# Altium project dark_knight.PrjPCB (part 1 of 2)
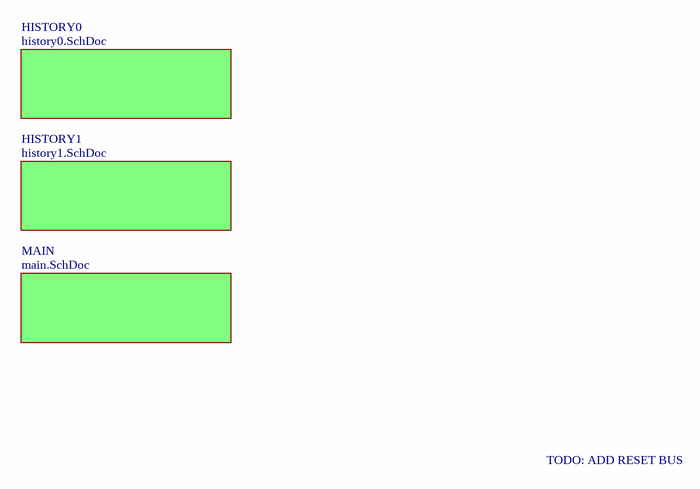
[diagram p0: top.SchDoc]
24 sheets, 105 parts. Net scope: flat (ports and power ports of the same name join across sheets).
Sheets:
  top.SchDoc
    MAIN = main.SchDoc
      ARRAY = array.SchDoc
        FPGA0 = fpga-top.SchDoc
          FPGA6 = fpga-bank6.SchDoc
          FPGA8 = fpga-bank8.SchDoc
          U_fpga-power = fpga-power.SchDoc
          U_fpga-misc = fpga-misc.SchDoc
        CFG = config-top.SchDoc
          CONFIG0 = config-bank0.SchDoc
          CONFIG1 = config-bank1.SchDoc
          CONFIG3 = config-bank3.SchDoc
          CONFIG4 = config-bank4.SchDoc
          CONFIG6 = config-bank6.SchDoc
          CONFIG7 = config-bank7.SchDoc
          CONFIG2 = config-bank2.SchDoc
          CONFIG8 = config-bank8.SchDoc
          CONFIGMISC = config-misc.SchDoc
          CONFIGGND = config-ground.SchDoc
          CONFIGPWR = config-power.SchDoc
          CONFIGSERDES = config-serdes.SchDoc
    HISTORY0 = history0.SchDoc
  power-v2v5.SchDoc
  power-v1v5.SchDoc

## Sheet top.SchDoc
size Letter; CompanyName: Brinton Engineering, LLC; Address1: 3479 Edison Way; Address2: Menlo Park CA 94025; Address3: +1 (877) 778-8435; Address4: brintonengineering.com; Revision: 1; SheetNumber: 1; SheetTotal: 1

### Sub-sheets
HISTORY0 = history0.SchDoc: no entries
HISTORY1 = history1.SchDoc (file not in this document): no entries
MAIN = main.SchDoc: no entries

### Notes on the sheet
- TODO: ADD RESET BUS
- Title
- Engineer
- Revision
- Drawn By
- Checked By
- Date
- Sheet
- of

## Sheet main.SchDoc
size Letter; CompanyName: Brinton Engineering, LLC; Address1: 3479 Edison Way; Address2: Menlo Park CA 94025; Address3: +1 (877) 778-8435; Address4: brintonengineering.com; Revision: 1; SheetNumber: 1; SheetTotal: 1
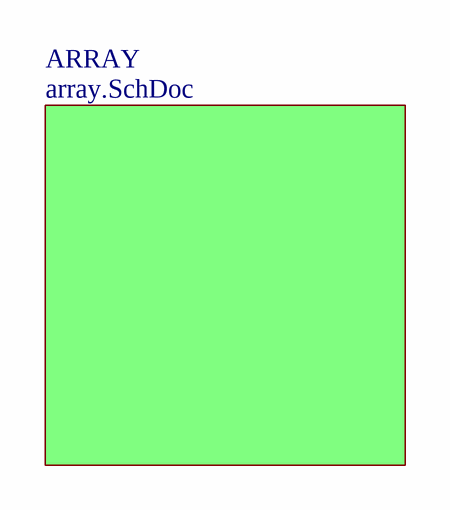
[diagram p1: main.SchDoc]

### Sub-sheets
ARRAY = array.SchDoc: no entries

### Notes on the sheet
- Title
- Engineer
- Revision
- Drawn By
- Checked By
- Date
- Sheet
- of

## Sheet array.SchDoc
size Letter; CompanyName: Brinton Engineering, LLC; Address1: 3479 Edison Way; Address2: Menlo Park CA 94025; Address3: +1 (877) 778-8435; Address4: brintonengineering.com; Revision: 1; SheetNumber: 1; SheetTotal: 1
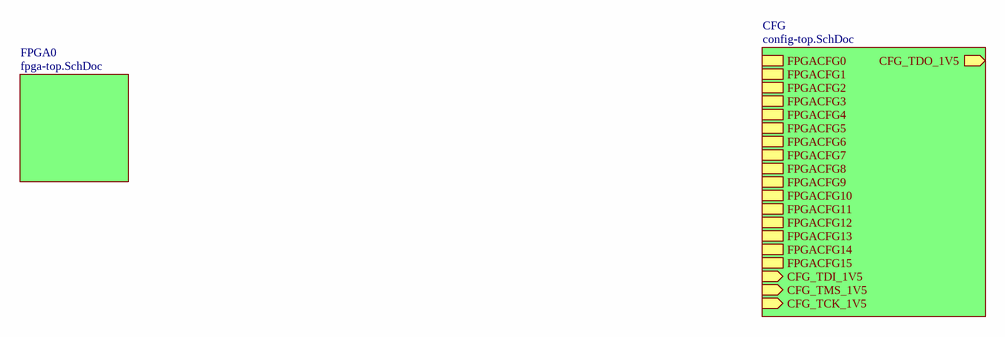
[diagram p2: array.SchDoc]

### Sub-sheets
CFG = config-top.SchDoc: FPGACFG0, FPGACFG1, FPGACFG2, FPGACFG3, FPGACFG4, FPGACFG5, FPGACFG6, FPGACFG7, FPGACFG8, FPGACFG9, FPGACFG10, FPGACFG11, FPGACFG12, FPGACFG13, FPGACFG14, FPGACFG15, CFG_TDI_1V5 (in), CFG_TMS_1V5 (in), CFG_TCK_1V5 (in), CFG_TDO_1V5 (out)
FPGA0 = fpga-top.SchDoc: no entries

### Notes on the sheet
- Title
- Engineer
- Revision
- Drawn By
- Checked By
- Date
- Sheet
- of

## Sheet fpga-top.SchDoc
size Letter; CompanyName: Brinton Engineering, LLC; Address1: 3479 Edison Way; Address2: Menlo Park CA 94025; Address3: +1 (877) 778-8435; Address4: brintonengineering.com; Revision: 1; SheetNumber: 1; SheetTotal: 1
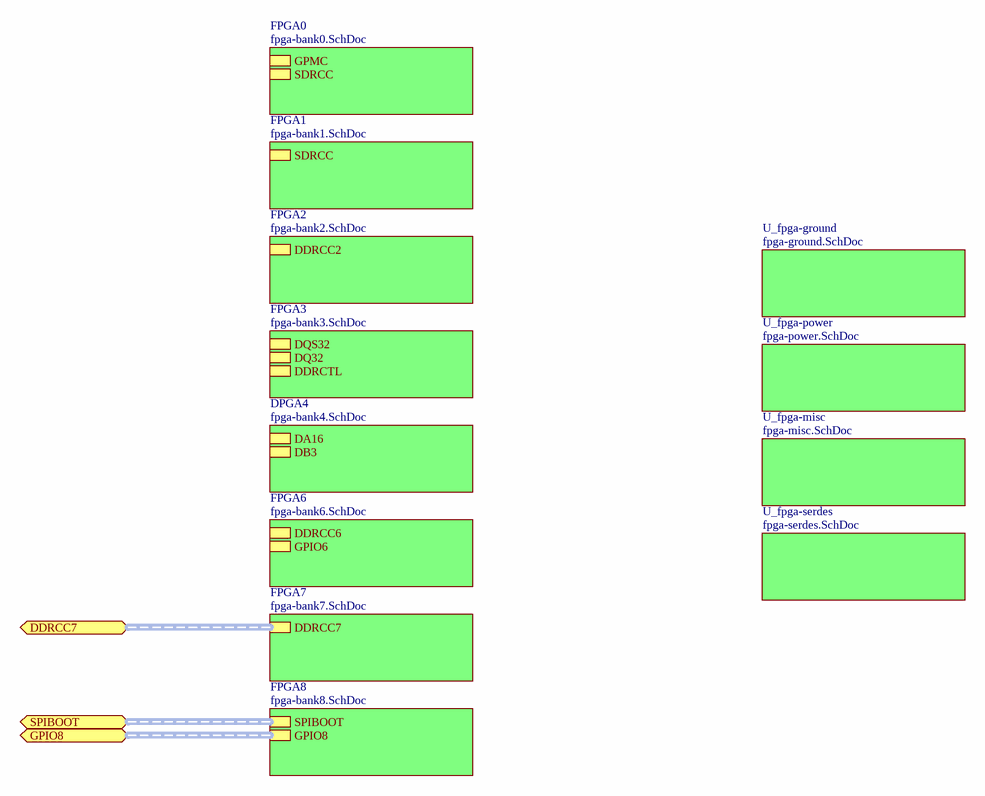
[diagram p3: fpga-top.SchDoc]

### Sub-sheets
DPGA4 = fpga-bank4.SchDoc (file not in this document): DA16 (harness DA16), DB3 (harness DB3)
FPGA0 = fpga-bank0.SchDoc (file not in this document): GPMC (harness GPMC), SDRCC (harness SDRCC)
FPGA1 = fpga-bank1.SchDoc (file not in this document): SDRCC (harness SDRCC)
FPGA2 = fpga-bank2.SchDoc (file not in this document): DDRCC2 (harness DDRCC)
FPGA3 = fpga-bank3.SchDoc (file not in this document): DQS32 (harness DQS32), DQ32 (harness DQ32), DDRCTL (harness DDRCTL)
FPGA6 = fpga-bank6.SchDoc: DDRCC6 (harness DDRCC), GPIO6 (harness GPIO8)
FPGA7 = fpga-bank7.SchDoc (file not in this document): DDRCC7 (harness DDRCC)
FPGA8 = fpga-bank8.SchDoc: SPIBOOT (harness SPIBOOT), GPIO8 (harness GPIO8)
U_fpga-ground = fpga-ground.SchDoc (file not in this document): no entries
U_fpga-misc = fpga-misc.SchDoc: no entries
U_fpga-power = fpga-power.SchDoc: no entries
U_fpga-serdes = fpga-serdes.SchDoc (file not in this document): no entries

### Ports
DDRCC7, GPIO8, SPIBOOT

### Buses and harness runs
harness port DDRCC7 = sheet FPGA7/DDRCC7
harness port GPIO8 = sheet FPGA8/GPIO8
harness port SPIBOOT = sheet FPGA8/SPIBOOT

### Notes on the sheet
- Title
- Engineer
- Revision
- Drawn By
- Checked By
- Date
- Sheet
- of

## Sheet fpga-bank6.SchDoc: FPGA - Bank 6
size Letter; CompanyName: Brinton Engineering, LLC; Address1: 3479 Edison Way; Address2: Menlo Park CA 94025; Address3: +1 (877) 778-8435; Address4: brintonengineering.com; Revision: 1; SheetNumber: 1; SheetTotal: 1
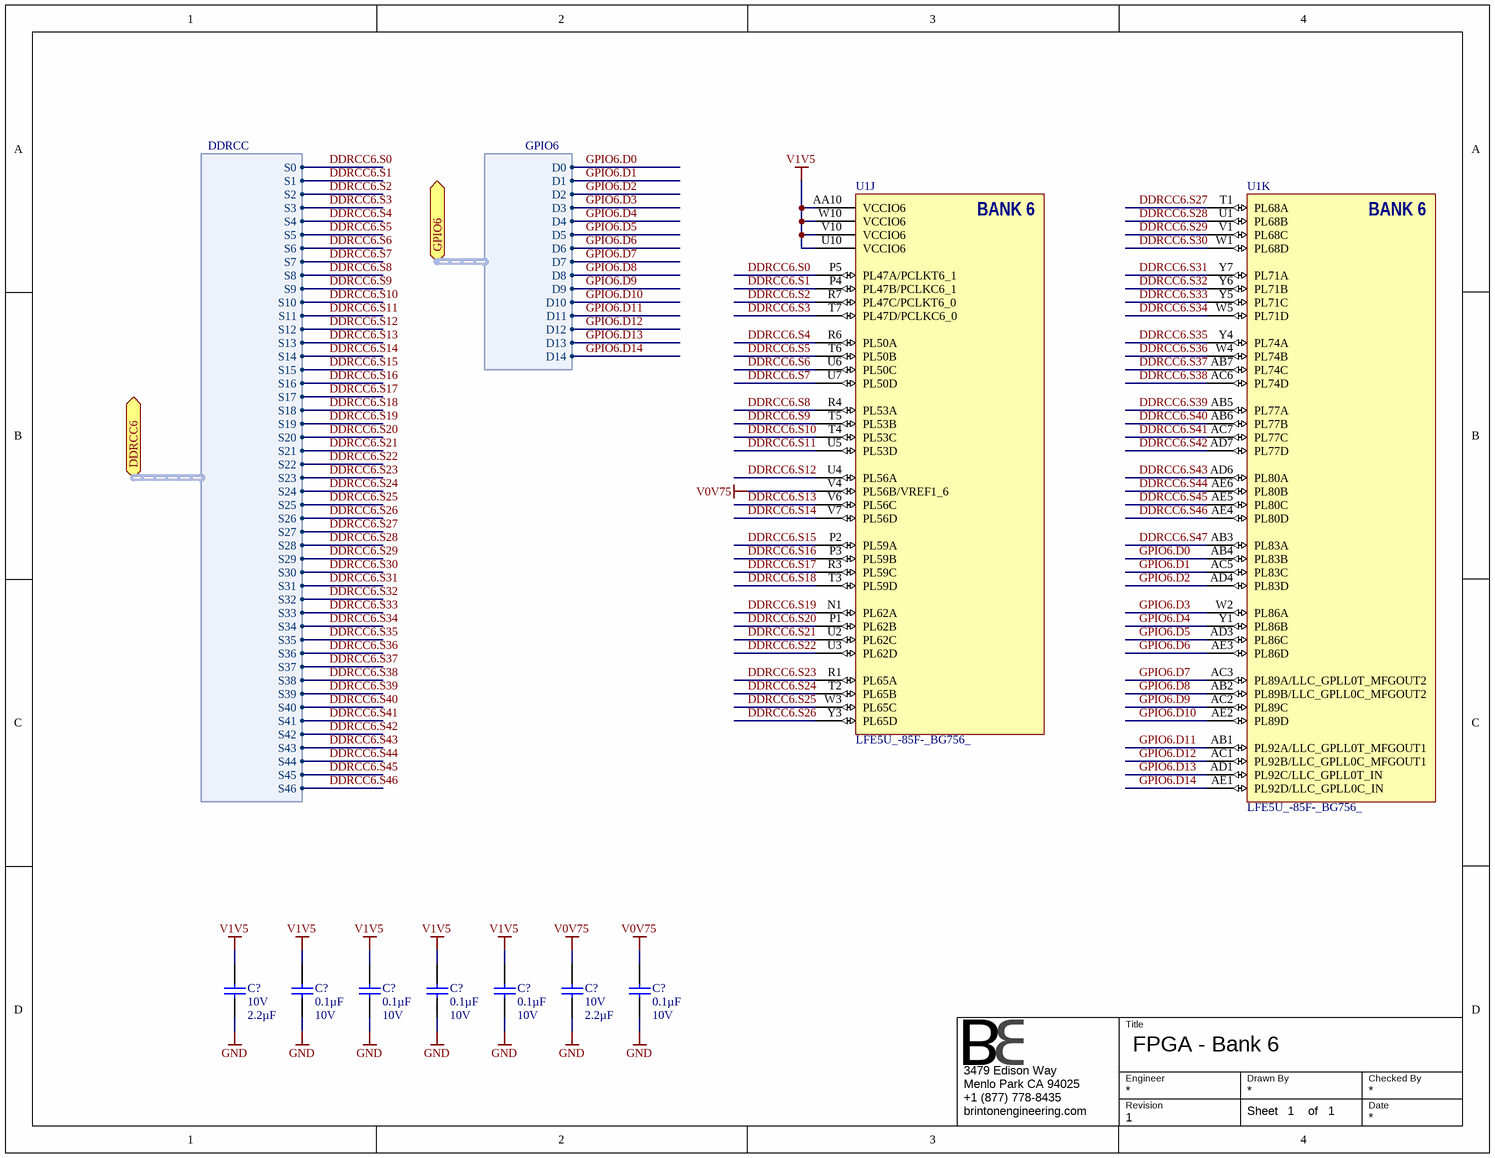
[diagram p4: fpga-bank6.SchDoc]

### Parts
(Parts that share a designator on the sheet are numbered #1, #2 ... from top to bottom, then left to right.)
C?#1  Voltage - Rated: 10V  Capacitance: 2.2µF  [CAPC1608X90N]  (hidden comment: GRM188R71A225KE15D)
C?#2  Capacitance: 0.1µF  Voltage - Rated: 10V  [CAPC1005X56N]  (hidden comment: GRM155R71A104KA01J)
C?#3  Capacitance: 0.1µF  Voltage - Rated: 10V  [CAPC1005X56N]  (hidden comment: GRM155R71A104KA01J)
C?#4  Capacitance: 0.1µF  Voltage - Rated: 10V  [CAPC1005X56N]  (hidden comment: GRM155R71A104KA01J)
C?#5  Capacitance: 0.1µF  Voltage - Rated: 10V  [CAPC1005X56N]  (hidden comment: GRM155R71A104KA01J)
C?#6  Voltage - Rated: 10V  Capacitance: 2.2µF  [CAPC1608X90N]  (hidden comment: GRM188R71A225KE15D)
C?#7  Capacitance: 0.1µF  Voltage - Rated: 10V  [CAPC1005X56N]  (hidden comment: GRM155R71A104KA01J)
U1  LFE5U_-85F-_BG756_  [caBGA756]  (parts J,K of 19)

### Ports
DDRCC6 (harness DDRCC), GPIO6 (harness GPIO6)

### Harnesses
DDRCC: S0, S1, S2, S3, S4, S5, S6, S7, S8, S9, S10, S11, S12, S13, S14, S15, S16, S17, S18, S19, S20, S21, S22, S23, S24, S25, S26, S27, S28, S29, S30, S31, S32, S33, S34, S35, S36, S37, S38, S39, S40, S41, S42, S43, S44, S45, S46
GPIO6: D0, D1, D2, D3, D4, D5, D6, D7, D8, D9, D10, D11, D12, D13, D14

### Nets
GND: C?#1.1 C?#2.1 C?#3.1 C?#4.1 C?#5.1 C?#6.1 C?#7.1
V0V75: C?#6.2 C?#7.2 U1.V4(PL56B/VREF1_6)
V1V5: C?#1.2 C?#2.2 C?#3.2 C?#4.2 C?#5.2 U1.AA10(VCCIO6) U1.U10(VCCIO6) U1.V10(VCCIO6) U1.W10(VCCIO6)
DDRCC6.S0: U1.P5(PL47A/PCLKT6_1) ; port DDRCC6.S0
DDRCC6.S1: U1.P4(PL47B/PCLKC6_1) ; port DDRCC6.S1
DDRCC6.S2: U1.R7(PL47C/PCLKT6_0) ; port DDRCC6.S2
DDRCC6.S3: U1.T7(PL47D/PCLKC6_0) ; port DDRCC6.S3
DDRCC6.S4: U1.R6(PL50A) ; port DDRCC6.S4
DDRCC6.S5: U1.T6(PL50B) ; port DDRCC6.S5
DDRCC6.S6: U1.U6(PL50C) ; port DDRCC6.S6
DDRCC6.S7: U1.U7(PL50D) ; port DDRCC6.S7
DDRCC6.S8: U1.R4(PL53A) ; port DDRCC6.S8
DDRCC6.S9: U1.T5(PL53B) ; port DDRCC6.S9
DDRCC6.S10: U1.T4(PL53C) ; port DDRCC6.S10
DDRCC6.S11: U1.U5(PL53D) ; port DDRCC6.S11
DDRCC6.S12: U1.U4(PL56A) ; port DDRCC6.S12
DDRCC6.S13: U1.V6(PL56C) ; port DDRCC6.S13
DDRCC6.S14: U1.V7(PL56D) ; port DDRCC6.S14
DDRCC6.S15: U1.P2(PL59A) ; port DDRCC6.S15
DDRCC6.S16: U1.P3(PL59B) ; port DDRCC6.S16
DDRCC6.S17: U1.R3(PL59C) ; port DDRCC6.S17
DDRCC6.S18: U1.T3(PL59D) ; port DDRCC6.S18
DDRCC6.S19: U1.N1(PL62A) ; port DDRCC6.S19
DDRCC6.S20: U1.P1(PL62B) ; port DDRCC6.S20
DDRCC6.S21: U1.U2(PL62C) ; port DDRCC6.S21
DDRCC6.S22: U1.U3(PL62D) ; port DDRCC6.S22
DDRCC6.S23: U1.R1(PL65A) ; port DDRCC6.S23
DDRCC6.S24: U1.T2(PL65B) ; port DDRCC6.S24
DDRCC6.S25: U1.W3(PL65C) ; port DDRCC6.S25
DDRCC6.S26: U1.Y3(PL65D) ; port DDRCC6.S26
DDRCC6.S27: U1.T1(PL68A) ; port DDRCC6.S27
DDRCC6.S28: U1.U1(PL68B) ; port DDRCC6.S28
DDRCC6.S29: U1.V1(PL68C) ; port DDRCC6.S29
DDRCC6.S30: U1.W1(PL68D) ; port DDRCC6.S30
DDRCC6.S31: U1.Y7(PL71A) ; port DDRCC6.S31
DDRCC6.S32: U1.Y6(PL71B) ; port DDRCC6.S32
DDRCC6.S33: U1.Y5(PL71C) ; port DDRCC6.S33
DDRCC6.S34: U1.W5(PL71D) ; port DDRCC6.S34
DDRCC6.S35: U1.Y4(PL74A) ; port DDRCC6.S35
DDRCC6.S36: U1.W4(PL74B) ; port DDRCC6.S36
DDRCC6.S37: U1.AB7(PL74C) ; port DDRCC6.S37
DDRCC6.S38: U1.AC6(PL74D) ; port DDRCC6.S38
DDRCC6.S39: U1.AB5(PL77A) ; port DDRCC6.S39
DDRCC6.S40: U1.AB6(PL77B) ; port DDRCC6.S40
DDRCC6.S41: U1.AC7(PL77C) ; port DDRCC6.S41
DDRCC6.S42: U1.AD7(PL77D) ; port DDRCC6.S42
DDRCC6.S43: U1.AD6(PL80A) ; port DDRCC6.S43
DDRCC6.S44: U1.AE6(PL80B) ; port DDRCC6.S44
DDRCC6.S45: U1.AE5(PL80C) ; port DDRCC6.S45
DDRCC6.S46: U1.AE4(PL80D) ; port DDRCC6.S46
DDRCC6.S47: U1.AB3(PL83A)
GPIO6.D0: U1.AB4(PL83B) ; port GPIO6.D0
GPIO6.D1: U1.AC5(PL83C) ; port GPIO6.D1
GPIO6.D2: U1.AD4(PL83D) ; port GPIO6.D2
GPIO6.D3: U1.W2(PL86A) ; port GPIO6.D3
GPIO6.D4: U1.Y1(PL86B) ; port GPIO6.D4
GPIO6.D5: U1.AD3(PL86C) ; port GPIO6.D5
GPIO6.D6: U1.AE3(PL86D) ; port GPIO6.D6
GPIO6.D7: U1.AC3(PL89A/LLC_GPLL0T_MFGOUT2) ; port GPIO6.D7
GPIO6.D8: U1.AB2(PL89B/LLC_GPLL0C_MFGOUT2) ; port GPIO6.D8
GPIO6.D9: U1.AC2(PL89C) ; port GPIO6.D9
GPIO6.D10: U1.AE2(PL89D) ; port GPIO6.D10
GPIO6.D11: U1.AB1(PL92A/LLC_GPLL0T_MFGOUT1) ; port GPIO6.D11
GPIO6.D12: U1.AC1(PL92B/LLC_GPLL0C_MFGOUT1) ; port GPIO6.D12
GPIO6.D13: U1.AD1(PL92C/LLC_GPLL0T_IN) ; port GPIO6.D13
GPIO6.D14: U1.AE1(PL92D/LLC_GPLL0C_IN) ; port GPIO6.D14

### Notes on the sheet
- Title
- Engineer
- Revision
- Drawn By
- Checked By
- Date
- Sheet
- of

### Library data of the parts
C?#1 C?#6 = GRM188R71A225KE15D: CAP CER 2.2UF 10V 10% X7R 0603; Manufacturer: Murata Electronics North America; Manufacturer P/N: GRM188R71A225KE15D; Operating Temperature: -55°C ~ 125°C; Thickness (Max): 0.035" (0.90mm); Tolerance: ±10%; Package / Case: 0603 (1608 Metric); Temperature Coefficient: X7R; Supplier 1: Newark; Supplier 2: Digi-Key; RoHS: RoHS Compliant; Size / Dimension: 0.063" L x 0.031" W (1.60mm x 0.80mm); Mounting Type: Surface Mount, MLCC; ComponentLink1URL: http://www.murata.com/~/media/webrenewal/support/library/catalog/products/capacitor/mlcc/c02e.ashx; ComponentLink1Description: http://www.murata.com/~/media/webrenewal/support/library/catalog/products/capacitor/mlcc/c02e.ashx; Supplier Part Number 1: 72R4209; Supplier Part Number 2: 490-4520-1-ND
C?#2-C?#5 C?#7 = GRM155R71A104KA01J: CAP CER 0.1UF 10V 10% X7R 0402; Manufacturer: Murata Electronics North America; Manufacturer P/N: GRM155R71A104KA01J; Operating Temperature: -55°C ~ 125°C; Thickness (Max): 0.022" (0.55mm); Size / Dimension: 0.039" L x 0.020" W (1.00mm x 0.50mm); RoHS: RoHS Compliant; Mounting Type: Surface Mount, MLCC; Supplier 1: Digi-Key; ComponentLink1URL: http://www.murata.com/~/media/webrenewal/support/library/catalog/products/capacitor/mlcc/c02e.ashx; ComponentLink1Description: http://www.murata.com/~/media/webrenewal/support/library/catalog/products/capacitor/mlcc/c02e.ashx; Supplier Part Number 1: 490-6322-1-ND; Temperature Coefficient: X7R; Package / Case: 0402 (1005 Metric); Tolerance: ±10%
U1 = LFE5U_-85F-_BG756_: ECP5 FPGA, 85k LUT, 756-caBGA; Manufacturer: Lattice Semiconductor; Manufacturer P/N: LFE5U_-85F-_BG756_

## Sheet fpga-bank8.SchDoc: FPGA - Bank 8
size Letter; CompanyName: Brinton Engineering, LLC; Address1: 3479 Edison Way; Address2: Menlo Park CA 94025; Address3: +1 (877) 778-8435; Address4: brintonengineering.com; Revision: 1; SheetNumber: 1; SheetTotal: 1
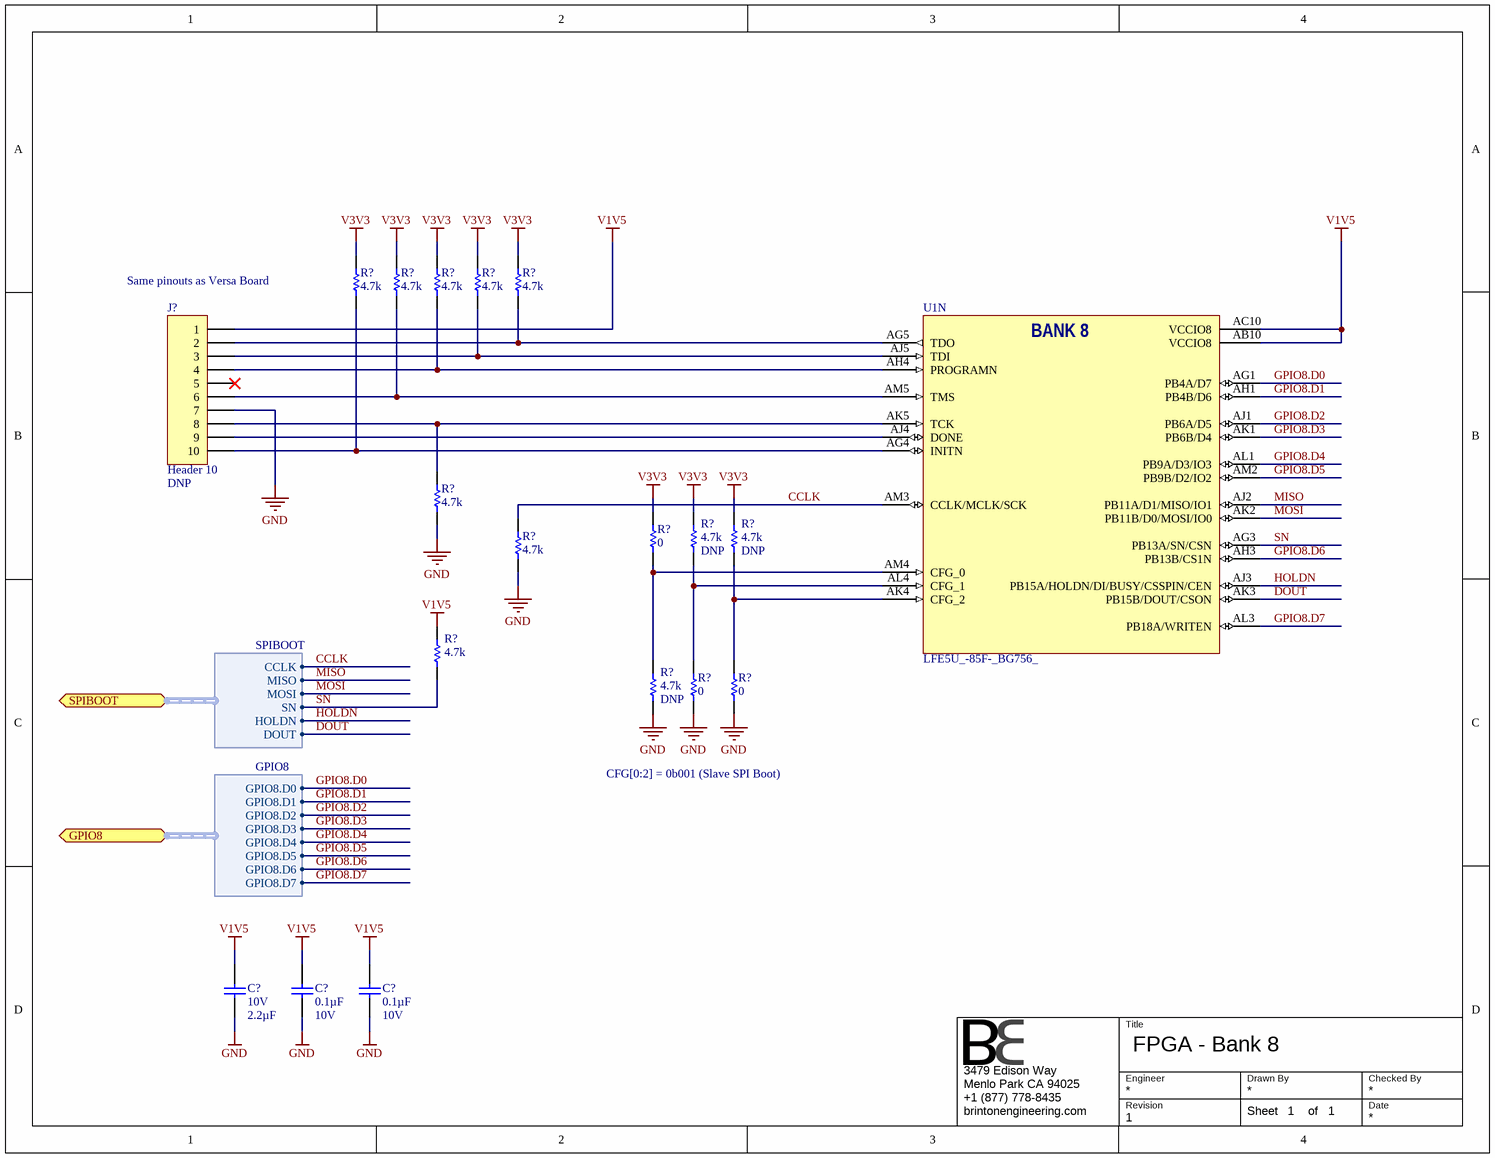
[diagram p5: fpga-bank8.SchDoc]

### Parts
(Parts that share a designator on the sheet are numbered #1, #2 ... from top to bottom, then left to right.)
C?#8  Voltage - Rated: 10V  Capacitance: 2.2µF  [CAPC1608X90N]  (hidden comment: GRM188R71A225KE15D)
C?#9  Capacitance: 0.1µF  Voltage - Rated: 10V  [CAPC1005X56N]  (hidden comment: GRM155R71A104KA01J)
C?#10  Capacitance: 0.1µF  Voltage - Rated: 10V  [CAPC1005X56N]  (hidden comment: GRM155R71A104KA01J)
J?  Header 10  Do Not Place: DNP  [HDR1X10]
R?#1  value 4.7k  [0603]  (hidden comment: RES 0603 4.7k 1%)
R?#2  value 4.7k  [0603]  (hidden comment: RES 0603 4.7k 1%)
R?#3  value 4.7k  [0603]  (hidden comment: RES 0603 4.7k 1%)
R?#4  value 4.7k  [0603]  (hidden comment: RES 0603 4.7k 1%)
R?#5  value 4.7k  [0603]  (hidden comment: RES 0603 4.7k 1%)
R?#6  value 4.7k  [0603]  (hidden comment: RES 0603 4.7k 1%)
R?#7  value 0  [0603]  (hidden comment: RES 0603 0)
R?#8  value 4.7k  Do Not Place: DNP  [0603]  (hidden comment: RES 0603 4.7k 1%)
R?#9  value 4.7k  Do Not Place: DNP  [0603]  (hidden comment: RES 0603 4.7k 1%)
R?#10  value 4.7k  [0603]  (hidden comment: RES 0603 4.7k 1%)
R?#11  value 4.7k  [0603]  (hidden comment: RES 0603 4.7k 1%)
R?#12  value 4.7k  Do Not Place: DNP  [0603]  (hidden comment: RES 0603 4.7k 1%)
R?#13  value 0  [0603]  (hidden comment: RES 0603 0)
R?#14  value 0  [0603]  (hidden comment: RES 0603 0)
U1  LFE5U_-85F-_BG756_  [caBGA756]  (part N of 19)

### Ports
GPIO8 (harness GPIO8), SPIBOOT (harness SPIBOOT)

### Harnesses
SPIBOOT: CCLK, MISO, MOSI, SN, HOLDN, DOUT
GPIO8: GPIO8.D0, GPIO8.D1, GPIO8.D2, GPIO8.D3, GPIO8.D4, GPIO8.D5, GPIO8.D6, GPIO8.D7

### Nets
GND: C?#8.1 C?#9.1 C?#10.1 J?.7 R?#6.1 R?#10.1 R?#12.1 R?#13.1 R?#14.1
V1V5: C?#8.2 C?#9.2 C?#10.2 J?.1 R?#11.2 U1.AB10(VCCIO8) U1.AC10(VCCIO8)
V3V3: R?#1.2 R?#2.2 R?#3.2 R?#4.2 R?#5.2 R?#7.2 R?#8.2 R?#9.2
CCLK: R?#10.2 U1.AM3(CCLK/MCLK/SCK) ; port SPIBOOT.CCLK
DOUT: U1.AK3(PB15B/DOUT/CSON) ; port SPIBOOT.DOUT
GPIO8.D0: U1.AG1(PB4A/D7) ; port GPIO8.GPIO8.D0
GPIO8.D1: U1.AH1(PB4B/D6) ; port GPIO8.GPIO8.D1
GPIO8.D2: U1.AJ1(PB6A/D5) ; port GPIO8.GPIO8.D2
GPIO8.D3: U1.AK1(PB6B/D4) ; port GPIO8.GPIO8.D3
GPIO8.D4: U1.AL1(PB9A/D3/IO3) ; port GPIO8.GPIO8.D4
GPIO8.D5: U1.AM2(PB9B/D2/IO2) ; port GPIO8.GPIO8.D5
GPIO8.D6: U1.AH3(PB13B/CS1N) ; port GPIO8.GPIO8.D6
GPIO8.D7: U1.AL3(PB18A/WRITEN) ; port GPIO8.GPIO8.D7
HOLDN: U1.AJ3(PB15A/HOLDN/DI/BUSY/CSSPIN/CEN) ; port SPIBOOT.HOLDN
MISO: U1.AJ2(PB11A/D1/MISO/IO1) ; port SPIBOOT.MISO
MOSI: U1.AK2(PB11B/D0/MOSI/IO0) ; port SPIBOOT.MOSI
SN: R?#11.1 U1.AG3(PB13A/SN/CSN) ; port SPIBOOT.SN
NetJ?_2: J?.2 R?#5.1 U1.AG5(TDO)
NetJ?_3: J?.3 R?#4.1 U1.AJ5(TDI)
NetJ?_4: J?.4 R?#3.1 U1.AH4(PROGRAMN)
NetJ?_6: J?.6 R?#2.1 U1.AM5(TMS)
NetJ?_8: J?.8 R?#6.2 U1.AK5(TCK)
NetJ?_9: J?.9 U1.AJ4(DONE)
NetJ?_10: J?.10 R?#1.1 U1.AG4(INITN)
NetR?#7_1: R?#7.1 R?#12.2 U1.AM4(CFG_0)
NetR?#8_1: R?#8.1 R?#13.2 U1.AL4(CFG_1)
NetR?#9_1: R?#9.1 R?#14.2 U1.AK4(CFG_2)

Not connected (* = marked no-connect by the designer): J? 5*

### Notes on the sheet
- (near J?) Same pinouts as Versa Board
- CFG[0:2] = 0b001 (Slave SPI Boot)
- Title
- Engineer
- Revision
- Drawn By
- Checked By
- Date
- Sheet
- of
- (in symbol LFE5U_-85F-_BG756_, part N) BANK 8

### Library data of the parts
C?#8 = GRM188R71A225KE15D: as C?#1 on sheet fpga-bank6; Manufacturer P/N: GRM188R71A225KE15D; Operating Temperature: -55°C ~ 125°C; Thickness (Max): 0.035" (0.90mm); Tolerance: ±10%; Package / Case: 0603 (1608 Metric); Temperature Coefficient: X7R; Supplier 1: Newark; Supplier 2: Digi-Key; RoHS: RoHS Compliant; Size / Dimension: 0.063" L x 0.031" W (1.60mm x 0.80mm); Mounting Type: Surface Mount, MLCC; ComponentLink1URL: http://www.murata.com/~/media/webrenewal/support/library/catalog/products/capacitor/mlcc/c02e.ashx; ComponentLink1Description: http://www.murata.com/~/media/webrenewal/support/library/catalog/products/capacitor/mlcc/c02e.ashx; Supplier Part Number 1: 72R4209; Supplier Part Number 2: 490-4520-1-ND
C?#9 C?#10 = GRM155R71A104KA01J: as C?#2 on sheet fpga-bank6; Manufacturer P/N: GRM155R71A104KA01J; Operating Temperature: -55°C ~ 125°C; Thickness (Max): 0.022" (0.55mm); Size / Dimension: 0.039" L x 0.020" W (1.00mm x 0.50mm); RoHS: RoHS Compliant; Mounting Type: Surface Mount, MLCC; Supplier 1: Digi-Key; ComponentLink1URL: http://www.murata.com/~/media/webrenewal/support/library/catalog/products/capacitor/mlcc/c02e.ashx; ComponentLink1Description: http://www.murata.com/~/media/webrenewal/support/library/catalog/products/capacitor/mlcc/c02e.ashx; Supplier Part Number 1: 490-6322-1-ND; Temperature Coefficient: X7R; Package / Case: 0402 (1005 Metric); Tolerance: ±10%
J? = Header 10: Header, 10-Pin; LatestRevisionDate: 17-Jul-2002; LatestRevisionNote: Re-released for DXP Platform.; Publisher: Altium Limited
R?#1-R?#6 R?#8-R?#12 = RES 0603 10k 1%: Thick Film Resistor 4.7k Ohms +/-1% 0.1W 75V SMD 0603; Manufacturer: Panasonic - ECG; Manufacturer P/N: ERJ3EKF4701V; Tcr: +/-100; Tr: -55:+155; Tolerance: +/-1%; Alternatives: *; Voltage: 75V; Power: 0.1W; P/N: ERJ3EKF4701V
  R?#11: Do Not Place: *
R?#7 R?#13 R?#14 = RES 0603 10k 1%: Thick Film Resistor 0 Ohms SMD 0603; Manufacturer: Panasonic - ECG; Manufacturer P/N: ERJ-3GEY0R00V; Tcr: +/-100; Tolerance: +/-1%; Tr: -55:+155; Voltage: 75V; Power: 0.1W; Alternatives: *; P/N: ERJ-3GEY0R00V
U1 = LFE5U_-85F-_BG756_: as U1 on sheet fpga-bank6; Manufacturer P/N: LFE5U_-85F-_BG756_

## Sheet fpga-power.SchDoc: FPGA - Power
size Letter; CompanyName: Brinton Engineering, LLC; Address1: 3479 Edison Way; Address2: Menlo Park CA 94025; Address3: +1 (877) 778-8435; Address4: brintonengineering.com; Revision: 1; SheetNumber: 1; SheetTotal: 1
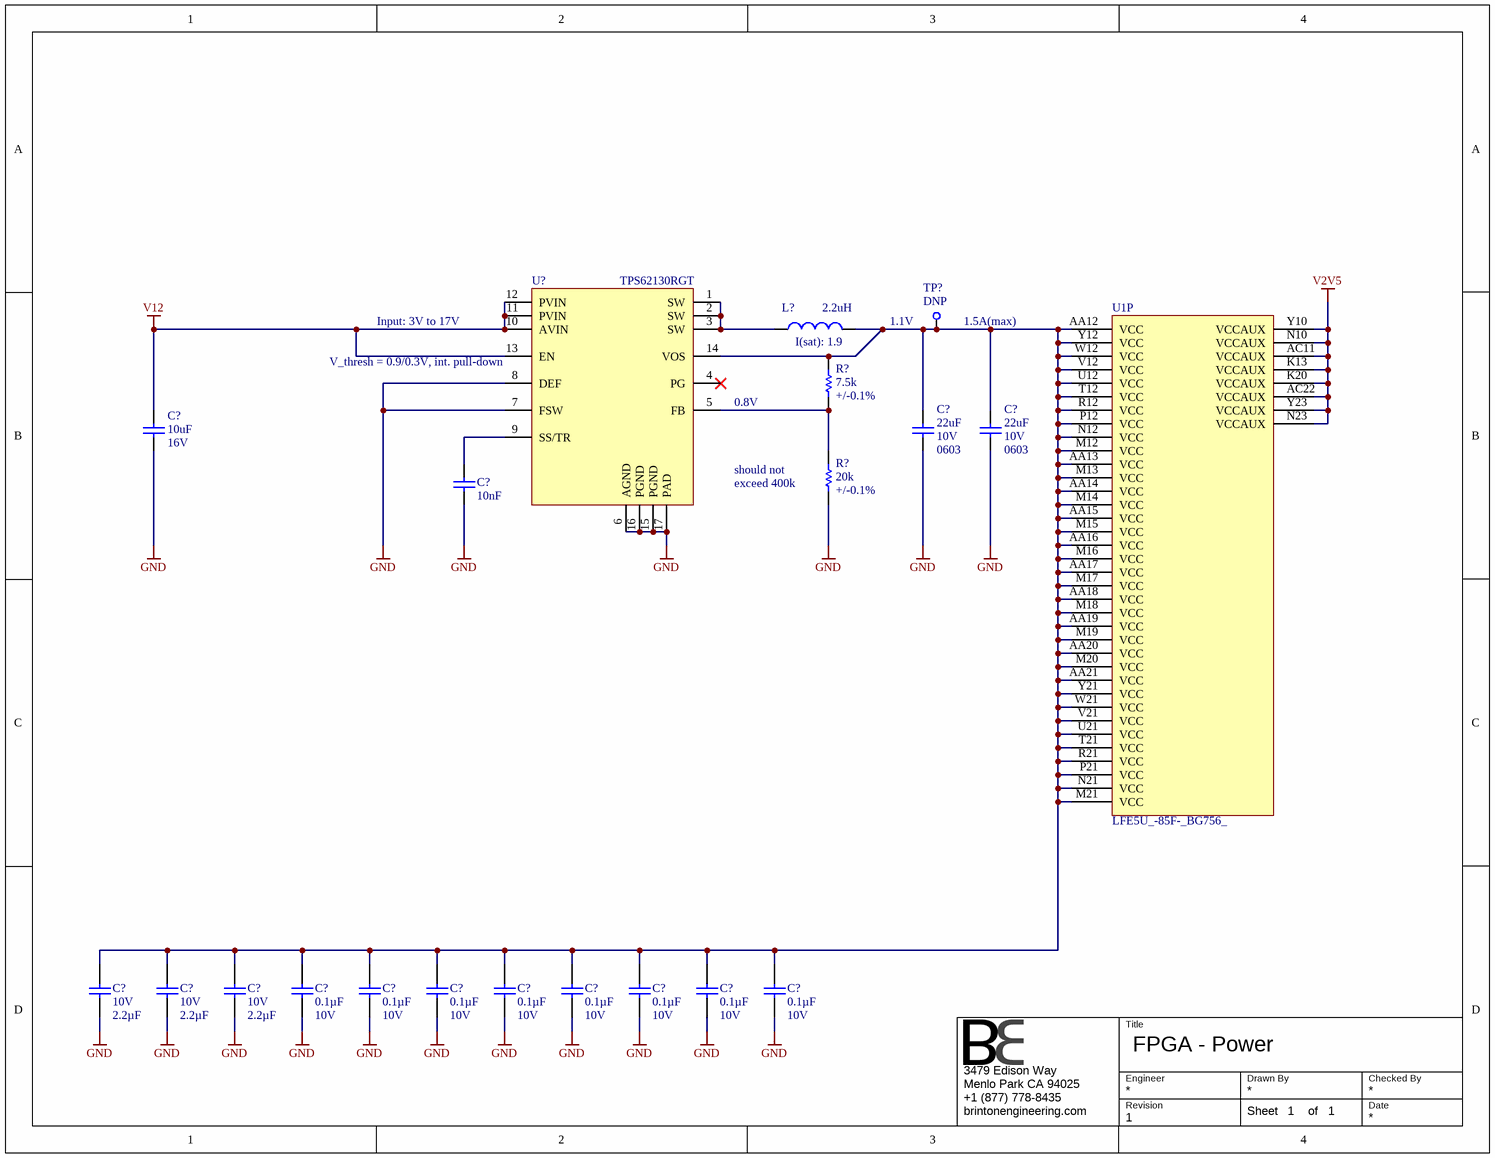
[diagram p6: fpga-power.SchDoc]

### Parts
(Parts that share a designator on the sheet are numbered #1, #2 ... from top to bottom, then left to right.)
C?#11  value 22uF  Voltage: 10V  [0603]  (hidden comment: C1608X5R1A226M080AC)
C?#12  value 22uF  Voltage: 10V  [0603]  (hidden comment: C1608X5R1A226M080AC)
C?#13  value 10uF  Voltage: 16V  [0603]  (hidden comment: CAP 10UF 0603)
C?#14  value 10nF  [0201]  (hidden comment: CAP 10NF 0201)
C?#15  Voltage - Rated: 10V  Capacitance: 2.2µF  [CAPC1608X90N]  (hidden comment: GRM188R71A225KE15D)
C?#16  Voltage - Rated: 10V  Capacitance: 2.2µF  [CAPC1608X90N]  (hidden comment: GRM188R71A225KE15D)
C?#17  Voltage - Rated: 10V  Capacitance: 2.2µF  [CAPC1608X90N]  (hidden comment: GRM188R71A225KE15D)
C?#18  Capacitance: 0.1µF  Voltage - Rated: 10V  [CAPC1005X56N]  (hidden comment: GRM155R71A104KA01J)
C?#19  Capacitance: 0.1µF  Voltage - Rated: 10V  [CAPC1005X56N]  (hidden comment: GRM155R71A104KA01J)
C?#20  Capacitance: 0.1µF  Voltage - Rated: 10V  [CAPC1005X56N]  (hidden comment: GRM155R71A104KA01J)
C?#21  Capacitance: 0.1µF  Voltage - Rated: 10V  [CAPC1005X56N]  (hidden comment: GRM155R71A104KA01J)
C?#22  Capacitance: 0.1µF  Voltage - Rated: 10V  [CAPC1005X56N]  (hidden comment: GRM155R71A104KA01J)
C?#23  Capacitance: 0.1µF  Voltage - Rated: 10V  [CAPC1005X56N]  (hidden comment: GRM155R71A104KA01J)
C?#24  Capacitance: 0.1µF  Voltage - Rated: 10V  [CAPC1005X56N]  (hidden comment: GRM155R71A104KA01J)
C?#25  Capacitance: 0.1µF  Voltage - Rated: 10V  [CAPC1005X56N]  (hidden comment: GRM155R71A104KA01J)
L?#1  value 2.2uH  I(sat): 1.9  [ASPI-3010FS]  (hidden comment: ASPI-0310FS-2R2M-T2)
R?#15  value 7.5k  Tolerance: +/-0.1%  [RESC1608X55N]  (hidden comment: RES 0603 7.5k 0.1%)
R?#16  value 20k  Tolerance: +/-0.1%  [RESC1608X55N]  (hidden comment: RES 0603 20k 0.1%)
TP?#1  Do Not Place: DNP  [TEST_POINT]  (hidden comment: TEST_POINT)
U1  LFE5U_-85F-_BG756_  [caBGA756]  (part P of 19)
U?#1  TPS62130RGT  [S-PQFP-8N]

### Nets
GND: C?#11.1 C?#12.1 C?#13.1 C?#14.2 C?#15.1 C?#16.1 C?#17.1 C?#18.1 C?#19.1 C?#20.1 C?#21.1 C?#22.1 C?#23.1 C?#24.1 C?#25.1 R?#16.1 U?#1.6(AGND) U?#1.7(FSW) U?#1.8(DEF) U?#1.15(PGND) U?#1.16(PGND) U?#1.17(PAD)
V2V5: U1.AC11(VCCAUX) U1.AC22(VCCAUX) U1.K13(VCCAUX) U1.K20(VCCAUX) U1.N10(VCCAUX) U1.N23(VCCAUX) U1.Y10(VCCAUX) U1.Y23(VCCAUX)
V12: C?#13.2 U?#1.10(AVIN) U?#1.11(PVIN) U?#1.12(PVIN) U?#1.13(EN)
NetC?#11_2: C?#11.2 C?#12.2 C?#15.2 C?#16.2 C?#17.2 C?#18.2 C?#19.2 C?#20.2 C?#21.2 C?#22.2 C?#23.2 C?#24.2 C?#25.2 L?#1.2 R?#15.2 TP?#1.1 U1.AA12(VCC) U1.AA13(VCC) U1.AA14(VCC) U1.AA15(VCC) U1.AA16(VCC) U1.AA17(VCC) U1.AA18(VCC) U1.AA19(VCC) U1.AA20(VCC) U1.AA21(VCC) U1.M12(VCC) U1.M13(VCC) U1.M14(VCC) U1.M15(VCC) U1.M16(VCC) U1.M17(VCC) U1.M18(VCC) U1.M19(VCC) U1.M20(VCC) U1.M21(VCC) U1.N12(VCC) U1.N21(VCC) U1.P12(VCC) U1.P21(VCC) U1.R12(VCC) U1.R21(VCC) U1.T12(VCC) U1.T21(VCC) U1.U12(VCC) U1.U21(VCC) U1.V12(VCC) U1.V21(VCC) U1.W12(VCC) U1.W21(VCC) U1.Y12(VCC) U1.Y21(VCC) U?#1.14(VOS)
NetC?#14_1: C?#14.1 U?#1.9(SS/TR)
NetL?#1_1: L?#1.1 U?#1.1(SW) U?#1.2(SW) U?#1.3(SW)
NetR?#15_1: R?#15.1 R?#16.2 U?#1.5(FB)

Not connected (* = marked no-connect by the designer): U?#1 4(PG)*

### Notes on the sheet
- (near U?#1) V_thresh = 0.9/0.3V, int. pull-down
- Input: 3V to 17V
- (near TP?#1) 1.1V
- (near TP?#1) 1.5A(max)
- (near U?#1) 0.8V
- should not
- exceed 400k
- Title
- Engineer
- Revision
- Drawn By
- Checked By
- Date
- Sheet
- of

### Library data of the parts
C?#11 C?#12 = CAP: Ceramic Capacitor 22uF +/-20% 10V X5R SMD 0603; Manufacturer: TDK Corporation; Tr: -55:85; Manufacturer P/N: C1608X5R1A226M080AC; Tolerance: +/-20%
C?#13 = CAP: Ceramic Capacitor 10uF +/-20% 16V X5R 0603; Manufacturer: Taiyo Yuden; Manufacturer P/N: EMK107BBJ106MA-T; Tolerance: *; Footprint: *; Tr: *; Distributor: Digi-Key; Distributor P/N: *
C?#14 = CAP: Ceramic Capacitor 10nF +/-10% 10V X5R 0201; Manufacturer: TDK Corporation; Manufacturer P/N: C0603X5R1A103K030BA; Tolerance: *; Voltage: 10V; Footprint: *; Tr: *; Distributor: Digi-Key; Distributor P/N: *
C?#15-C?#17 = GRM188R71A225KE15D: as C?#1 on sheet fpga-bank6; Manufacturer P/N: GRM188R71A225KE15D; Operating Temperature: -55°C ~ 125°C; Thickness (Max): 0.035" (0.90mm); Tolerance: ±10%; Package / Case: 0603 (1608 Metric); Temperature Coefficient: X7R; Supplier 1: Newark; Supplier 2: Digi-Key; RoHS: RoHS Compliant; Size / Dimension: 0.063" L x 0.031" W (1.60mm x 0.80mm); Mounting Type: Surface Mount, MLCC; ComponentLink1URL: http://www.murata.com/~/media/webrenewal/support/library/catalog/products/capacitor/mlcc/c02e.ashx; ComponentLink1Description: http://www.murata.com/~/media/webrenewal/support/library/catalog/products/capacitor/mlcc/c02e.ashx; Supplier Part Number 1: 72R4209; Supplier Part Number 2: 490-4520-1-ND
C?#18-C?#25 = GRM155R71A104KA01J: as C?#2 on sheet fpga-bank6; Manufacturer P/N: GRM155R71A104KA01J; Operating Temperature: -55°C ~ 125°C; Thickness (Max): 0.022" (0.55mm); Size / Dimension: 0.039" L x 0.020" W (1.00mm x 0.50mm); RoHS: RoHS Compliant; Mounting Type: Surface Mount, MLCC; Supplier 1: Digi-Key; ComponentLink1URL: http://www.murata.com/~/media/webrenewal/support/library/catalog/products/capacitor/mlcc/c02e.ashx; ComponentLink1Description: http://www.murata.com/~/media/webrenewal/support/library/catalog/products/capacitor/mlcc/c02e.ashx; Supplier Part Number 1: 490-6322-1-ND; Temperature Coefficient: X7R; Package / Case: 0402 (1005 Metric); Tolerance: ±10%
L?#1 = COIL: Wirewound Inductor 2.2uH +/-20% 1.9A SMD 2518; Manufacturer: Abracon; Manufacturer P/N: ASPI-0310FS-2R2M-T2
R?#15 = RES 0603 10k 1%: Thick Film Resistor 7.5k Ohms +/-0.1% 0.1W 75V SMD 0603; Manufacturer: Panasonic - ECG; Manufacturer P/N: ERA-3APB752V; Tcr: +/-15; Tr: -55:+125; Alternatives: *; Voltage: 75V; Power: 0.1W; Footprint: 0603; P/N: ERA-3APB752V
R?#16 = RES 0603 10k 1%: Thick Film Resistor 20k Ohms +/-0.1% 0.1W 75V SMD 0603; Manufacturer: Panasonic - ECG; Manufacturer P/N: ERA-3APB203V; Tcr: +/-15; Tr: -55:+125; Alternatives: *; Voltage: 75V; Power: 0.1W; Footprint: 0603; P/N: ERA-3APB203V
TP?#1 = TEST_POINT: Thruhole Miniature Test Point; Manufacturer P/N: 5000; Manufacturer: Keystone Electronics Corp
U1 = LFE5U_-85F-_BG756_: as U1 on sheet fpga-bank6; Manufacturer P/N: LFE5U_-85F-_BG756_
U?#1 = TPS62130RGT: 3-17V 3A Step-Down Converter VQFN; Manufacturer: Texas Instruments; Manufacturer P/N: TPS62130RGT

## Sheet fpga-misc.SchDoc
size Letter; CompanyName: Brinton Engineering, LLC; DrawnBy: FPGA - Misc; Address1: 3479 Edison Way; Address2: Menlo Park CA 94025; Address3: +1 (877) 778-8435; Address4: brintonengineering.com; Revision: 1; SheetNumber: 1; SheetTotal: 1
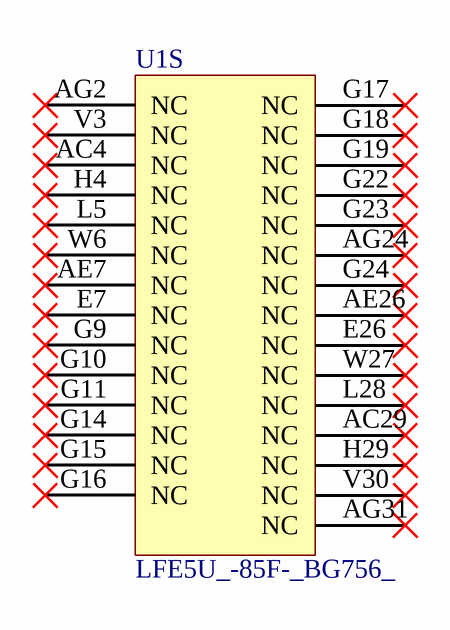
[diagram p7: fpga-misc.SchDoc]

### Parts
U1  LFE5U_-85F-_BG756_  [caBGA756]  (part S of 19)

### Nets

Not connected (* = marked no-connect by the designer): U1 AC4(NC)* AC29(NC)* AE7(NC)* AE26(NC)* AG2(NC)* AG24(NC)* AG31(NC)* E7(NC)* E26(NC)* G9(NC)* G10(NC)* G11(NC)* G14(NC)* G15(NC)* G16(NC)* G17(NC)* G18(NC)* G19(NC)* G22(NC)* G23(NC)* G24(NC)* H4(NC)* H29(NC)* L5(NC)* L28(NC)* V3(NC)* V30(NC)* W6(NC)* W27(NC)*

### Notes on the sheet
- Title
- Engineer
- Revision
- Drawn By
- Checked By
- Date
- Sheet
- of

### Library data of the parts
U1 = LFE5U_-85F-_BG756_: as U1 on sheet fpga-bank6; Manufacturer P/N: LFE5U_-85F-_BG756_

## Sheet config-top.SchDoc: Config FPGA - Top
size Letter; CompanyName: Brinton Engineering, LLC; Address1: 3479 Edison Way; Address2: Menlo Park CA 94025; Address3: +1 (877) 778-8435; Address4: brintonengineering.com; Revision: 1; SheetNumber: 1; SheetTotal: 1
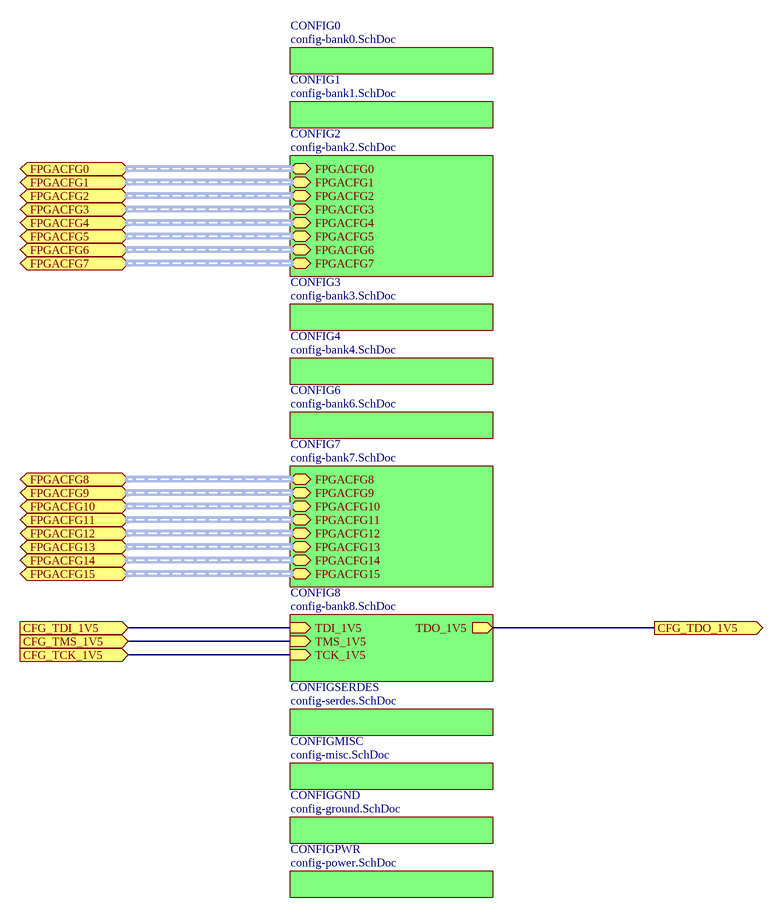
[diagram p8: config-top.SchDoc]

### Sub-sheets
CONFIG0 = config-bank0.SchDoc: no entries
CONFIG1 = config-bank1.SchDoc: no entries
CONFIG2 = config-bank2.SchDoc: FPGACFG0 (harness CONF_1V5), FPGACFG1 (harness CONF_1V5), FPGACFG2 (harness CONF_1V5), FPGACFG3 (harness CONF_1V5), FPGACFG4 (harness CONF_1V5), FPGACFG5 (harness CONF_1V5), FPGACFG6 (harness CONF_1V5), FPGACFG7 (harness CONF_1V5)
CONFIG3 = config-bank3.SchDoc: no entries
CONFIG4 = config-bank4.SchDoc: no entries
CONFIG6 = config-bank6.SchDoc: no entries
CONFIG7 = config-bank7.SchDoc: FPGACFG8 (harness CONF_1V5), FPGACFG9 (harness CONF_1V5), FPGACFG10 (harness CONF_1V5), FPGACFG11 (harness CONF_1V5), FPGACFG12 (harness CONF_1V5), FPGACFG13 (harness CONF_1V5), FPGACFG14 (harness CONF_1V5), FPGACFG15 (harness CONF_1V5)
CONFIG8 = config-bank8.SchDoc: TDO_1V5 (out), TDI_1V5 (in), TMS_1V5 (in), TCK_1V5 (in)
CONFIGGND = config-ground.SchDoc: no entries
CONFIGMISC = config-misc.SchDoc: no entries
CONFIGPWR = config-power.SchDoc: no entries
CONFIGSERDES = config-serdes.SchDoc: no entries

### Ports
CFG_TCK_1V5 (in), CFG_TDI_1V5 (in), CFG_TDO_1V5 (out), CFG_TMS_1V5 (in), FPGACFG0, FPGACFG1, FPGACFG2, FPGACFG3, FPGACFG4, FPGACFG5, FPGACFG6, FPGACFG7, FPGACFG8, FPGACFG9, FPGACFG10, FPGACFG11, FPGACFG12, FPGACFG13, FPGACFG14, FPGACFG15

### Nets
(unnamed): port CFG_TDI_1V5, sheet CONFIG8/TDI_1V5
(unnamed): port CFG_TMS_1V5, sheet CONFIG8/TMS_1V5
(unnamed): port CFG_TCK_1V5, sheet CONFIG8/TCK_1V5
(unnamed): port CFG_TDO_1V5, sheet CONFIG8/TDO_1V5

### Buses and harness runs
harness port FPGACFG0 = sheet CONFIG2/FPGACFG0
harness port FPGACFG1 = sheet CONFIG2/FPGACFG1
harness port FPGACFG2 = sheet CONFIG2/FPGACFG2
harness port FPGACFG3 = sheet CONFIG2/FPGACFG3
harness port FPGACFG4 = sheet CONFIG2/FPGACFG4
harness port FPGACFG5 = sheet CONFIG2/FPGACFG5
harness port FPGACFG6 = sheet CONFIG2/FPGACFG6
harness port FPGACFG7 = sheet CONFIG2/FPGACFG7
harness port FPGACFG8 = sheet CONFIG7/FPGACFG8
harness port FPGACFG9 = sheet CONFIG7/FPGACFG9
harness port FPGACFG10 = sheet CONFIG7/FPGACFG10
harness port FPGACFG11 = sheet CONFIG7/FPGACFG11
harness port FPGACFG12 = sheet CONFIG7/FPGACFG12
harness port FPGACFG13 = sheet CONFIG7/FPGACFG13
harness port FPGACFG14 = sheet CONFIG7/FPGACFG14
harness port FPGACFG15 = sheet CONFIG7/FPGACFG15

### Notes on the sheet
- Title
- Engineer
- Revision
- Drawn By
- Checked By
- Date
- Sheet
- of

## Sheet config-bank0.SchDoc: Config FPGA - Bank 0
size Letter; CompanyName: Brinton Engineering, LLC; Address1: 3479 Edison Way; Address2: Menlo Park CA 94025; Address3: +1 (877) 778-8435; Address4: brintonengineering.com; Revision: 1; SheetNumber: 1; SheetTotal: 1
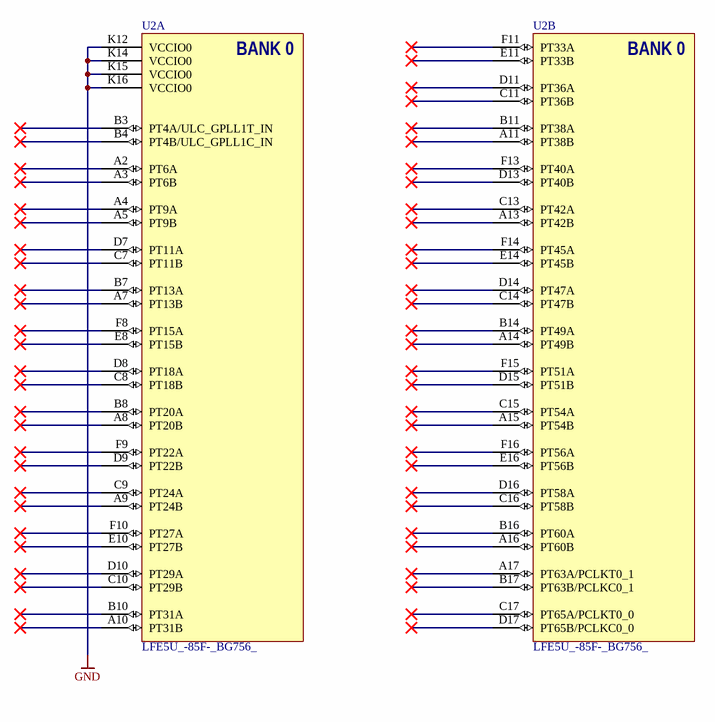
[diagram p9: config-bank0.SchDoc]

### Parts
U2  LFE5U_-85F-_BG756_  [caBGA756]  (parts A,B of 19)

### Nets
GND: U2.K12(VCCIO0) U2.K14(VCCIO0) U2.K15(VCCIO0) U2.K16(VCCIO0)

Not connected (* = marked no-connect by the designer): U2 A2(PT6A)* A3(PT6B)* A4(PT9A)* A5(PT9B)* A7(PT13B)* A8(PT20B)* A9(PT24B)* A10(PT31B)* A11(PT38B)* A13(PT42B)* A14(PT49B)* A15(PT54B)* A16(PT60B)* A17(PT63A/PCLKT0_1)* B3(PT4A/ULC_GPLL1T_IN)* B4(PT4B/ULC_GPLL1C_IN)* B7(PT13A)* B8(PT20A)* B10(PT31A)* B11(PT38A)* B14(PT49A)* B16(PT60A)* B17(PT63B/PCLKC0_1)* C7(PT11B)* C8(PT18B)* C9(PT24A)* C10(PT29B)* C11(PT36B)* C13(PT42A)* C14(PT47B)* C15(PT54A)* C16(PT58B)* C17(PT65A/PCLKT0_0)* D7(PT11A)* D8(PT18A)* D9(PT22B)* D10(PT29A)* D11(PT36A)* D13(PT40B)* D14(PT47A)* D15(PT51B)* D16(PT58A)* D17(PT65B/PCLKC0_0)* E8(PT15B)* E10(PT27B)* E11(PT33B)* E14(PT45B)* E16(PT56B)* F8(PT15A)* F9(PT22A)* F10(PT27A)* F11(PT33A)* F13(PT40A)* F14(PT45A)* F15(PT51A)* F16(PT56A)*

### Notes on the sheet
- Title
- Engineer
- Revision
- Drawn By
- Checked By
- Date
- Sheet
- of
- (in symbol LFE5U_-85F-_BG756_, part A) BANK 0
- (in symbol LFE5U_-85F-_BG756_, part B) BANK 0

### Library data of the parts
U2 = LFE5U_-85F-_BG756_: as U1 on sheet fpga-bank6; Manufacturer P/N: LFE5U_-85F-_BG756_

## Sheet config-bank1.SchDoc: Config FPGA - Bank 1
size Letter; CompanyName: Brinton Engineering, LLC; Address1: 3479 Edison Way; Address2: Menlo Park CA 94025; Address3: +1 (877) 778-8435; Address4: brintonengineering.com; Revision: 1; SheetNumber: 1; SheetTotal: 1
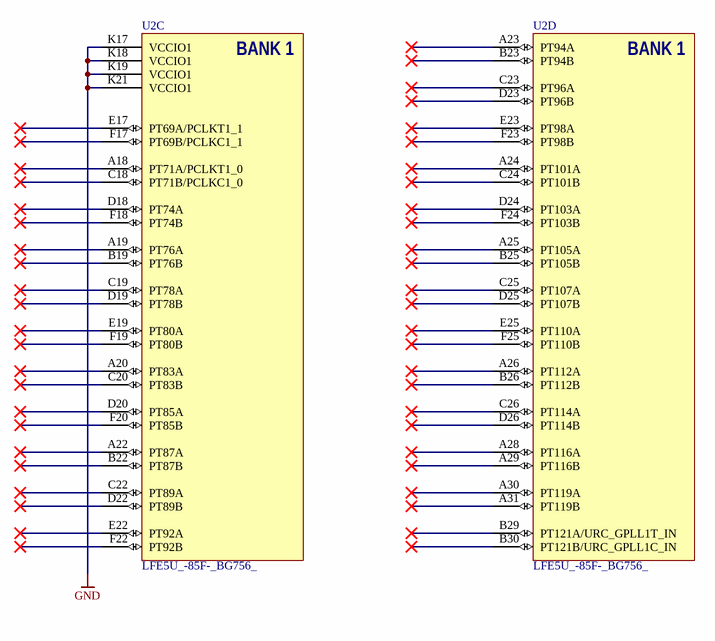
[diagram p10: config-bank1.SchDoc]

### Parts
U2  LFE5U_-85F-_BG756_  [caBGA756]  (parts C,D of 19)

### Nets
GND: U2.K17(VCCIO1) U2.K18(VCCIO1) U2.K19(VCCIO1) U2.K21(VCCIO1)

Not connected (* = marked no-connect by the designer): U2 A18(PT71A/PCLKT1_0)* A19(PT76A)* A20(PT83A)* A22(PT87A)* A23(PT94A)* A24(PT101A)* A25(PT105A)* A26(PT112A)* A28(PT116A)* A29(PT116B)* A30(PT119A)* A31(PT119B)* B19(PT76B)* B22(PT87B)* B23(PT94B)* B25(PT105B)* B26(PT112B)* B29(PT121A/URC_GPLL1T_IN)* B30(PT121B/URC_GPLL1C_IN)* C18(PT71B/PCLKC1_0)* C19(PT78A)* C20(PT83B)* C22(PT89A)* C23(PT96A)* C24(PT101B)* C25(PT107A)* C26(PT114A)* D18(PT74A)* D19(PT78B)* D20(PT85A)* D22(PT89B)* D23(PT96B)* D24(PT103A)* D25(PT107B)* D26(PT114B)* E17(PT69A/PCLKT1_1)* E19(PT80A)* E22(PT92A)* E23(PT98A)* E25(PT110A)* F17(PT69B/PCLKC1_1)* F18(PT74B)* F19(PT80B)* F20(PT85B)* F22(PT92B)* F23(PT98B)* F24(PT103B)* F25(PT110B)*

### Notes on the sheet
- Title
- Engineer
- Revision
- Drawn By
- Checked By
- Date
- Sheet
- of
- (in symbol LFE5U_-85F-_BG756_, part C) BANK 1
- (in symbol LFE5U_-85F-_BG756_, part D) BANK 1

### Library data of the parts
U2 = LFE5U_-85F-_BG756_: as U1 on sheet fpga-bank6; Manufacturer P/N: LFE5U_-85F-_BG756_

## Sheet config-bank3.SchDoc: Config FPGA - Bank 3
size Letter; CompanyName: Brinton Engineering, LLC; Address1: 3479 Edison Way; Address2: Menlo Park CA 94025; Address3: +1 (877) 778-8435; Address4: brintonengineering.com; Revision: 1; SheetNumber: 1; SheetTotal: 1
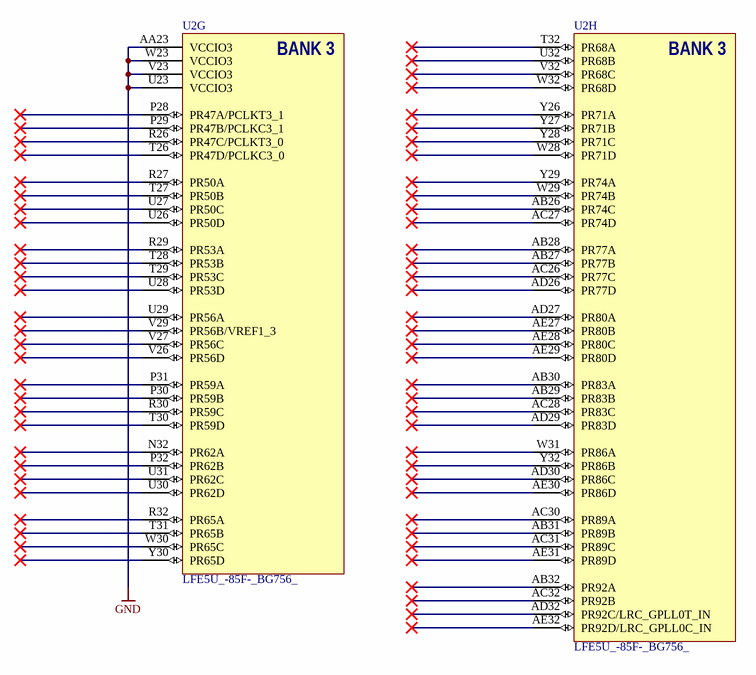
[diagram p11: config-bank3.SchDoc]

### Parts
U2  LFE5U_-85F-_BG756_  [caBGA756]  (parts G,H of 19)

### Nets
GND: U2.AA23(VCCIO3) U2.U23(VCCIO3) U2.V23(VCCIO3) U2.W23(VCCIO3)

Not connected (* = marked no-connect by the designer): U2 AB26(PR74C)* AB27(PR77B)* AB28(PR77A)* AB29(PR83B)* AB30(PR83A)* AB31(PR89B)* AB32(PR92A)* AC26(PR77C)* AC27(PR74D)* AC28(PR83C)* AC30(PR89A)* AC31(PR89C)* AC32(PR92B)* AD26(PR77D)* AD27(PR80A)* AD29(PR83D)* AD30(PR86C)* AD32(PR92C/LRC_GPLL0T_IN)* AE27(PR80B)* AE28(PR80C)* AE29(PR80D)* AE30(PR86D)* AE31(PR89D)* AE32(PR92D/LRC_GPLL0C_IN)* N32(PR62A)* P28(PR47A/PCLKT3_1)* P29(PR47B/PCLKC3_1)* P30(PR59B)* P31(PR59A)* P32(PR62B)* R26(PR47C/PCLKT3_0)* R27(PR50A)* R29(PR53A)* R30(PR59C)* R32(PR65A)* T26(PR47D/PCLKC3_0)* T27(PR50B)* T28(PR53B)* T29(PR53C)* T30(PR59D)* T31(PR65B)* T32(PR68A)* U26(PR50D)* U27(PR50C)* U28(PR53D)* U29(PR56A)* U30(PR62D)* U31(PR62C)* U32(PR68B)* V26(PR56D)* V27(PR56C)* V29(PR56B/VREF1_3)* V32(PR68C)* W28(PR71D)* W29(PR74B)* W30(PR65C)* W31(PR86A)* W32(PR68D)* Y26(PR71A)* Y27(PR71B)* Y28(PR71C)* Y29(PR74A)* Y30(PR65D)* Y32(PR86B)*

### Notes on the sheet
- Title
- Engineer
- Revision
- Drawn By
- Checked By
- Date
- Sheet
- of
- (in symbol LFE5U_-85F-_BG756_, part G) BANK 3
- (in symbol LFE5U_-85F-_BG756_, part H) BANK 3

### Library data of the parts
U2 = LFE5U_-85F-_BG756_: as U1 on sheet fpga-bank6; Manufacturer P/N: LFE5U_-85F-_BG756_

## Sheet config-bank4.SchDoc: Config FPGA - Bank 4
size Letter; CompanyName: Brinton Engineering, LLC; Address1: 3479 Edison Way; Address2: Menlo Park CA 94025; Address3: +1 (877) 778-8435; Address4: brintonengineering.com; Revision: 1; SheetNumber: 1; SheetTotal: 1
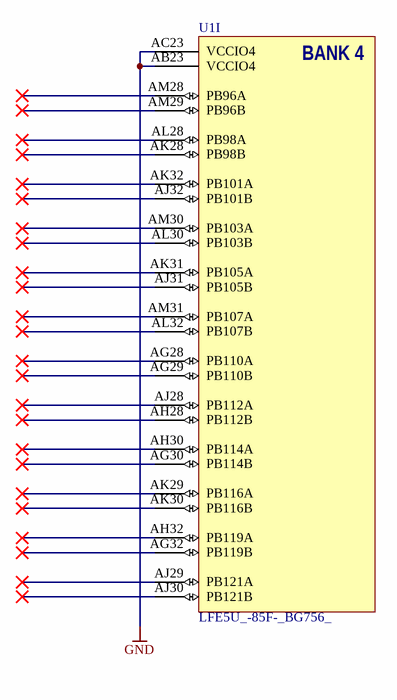
[diagram p12: config-bank4.SchDoc]

### Parts
U1  LFE5U_-85F-_BG756_  [caBGA756]  (part I of 19)

### Nets
GND: U1.AB23(VCCIO4) U1.AC23(VCCIO4)

Not connected (* = marked no-connect by the designer): U1 AG28(PB110A)* AG29(PB110B)* AG30(PB114B)* AG32(PB119B)* AH28(PB112B)* AH30(PB114A)* AH32(PB119A)* AJ28(PB112A)* AJ29(PB121A)* AJ30(PB121B)* AJ31(PB105B)* AJ32(PB101B)* AK28(PB98B)* AK29(PB116A)* AK30(PB116B)* AK31(PB105A)* AK32(PB101A)* AL28(PB98A)* AL30(PB103B)* AL32(PB107B)* AM28(PB96A)* AM29(PB96B)* AM30(PB103A)* AM31(PB107A)*

### Notes on the sheet
- Title
- Engineer
- Revision
- Drawn By
- Checked By
- Date
- Sheet
- of
- (in symbol LFE5U_-85F-_BG756_, part I) BANK 4

### Library data of the parts
U1 = LFE5U_-85F-_BG756_: as U1 on sheet fpga-bank6; Manufacturer P/N: LFE5U_-85F-_BG756_

## Sheet config-bank6.SchDoc: Config FPGA - Bank 6
size Letter; CompanyName: Brinton Engineering, LLC; Address1: 3479 Edison Way; Address2: Menlo Park CA 94025; Address3: +1 (877) 778-8435; Address4: brintonengineering.com; Revision: 1; SheetNumber: 1; SheetTotal: 1
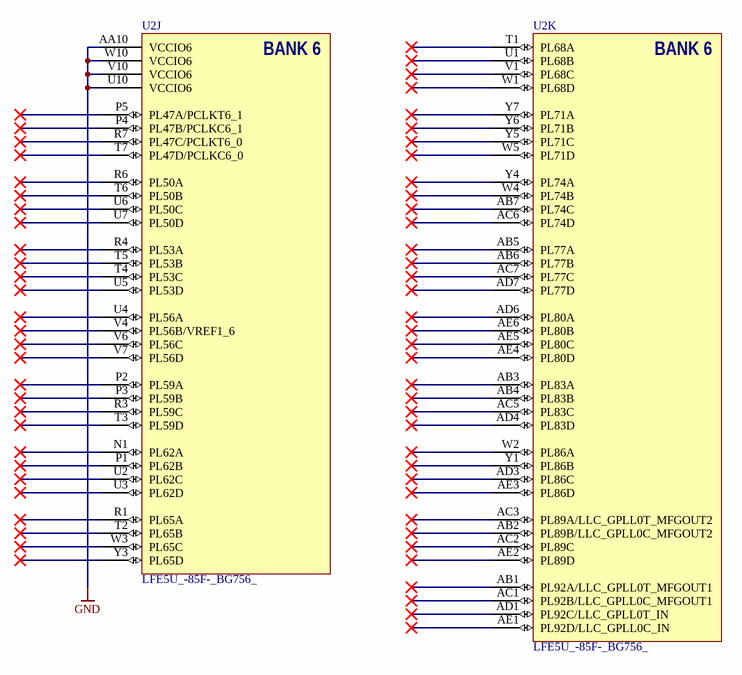
[diagram p13: config-bank6.SchDoc]

### Parts
U2  LFE5U_-85F-_BG756_  [caBGA756]  (parts J,K of 19)

### Nets
GND: U2.AA10(VCCIO6) U2.U10(VCCIO6) U2.V10(VCCIO6) U2.W10(VCCIO6)

Not connected (* = marked no-connect by the designer): U2 AB1(PL92A/LLC_GPLL0T_MFGOUT1)* AB2(PL89B/LLC_GPLL0C_MFGOUT2)* AB3(PL83A)* AB4(PL83B)* AB5(PL77A)* AB6(PL77B)* AB7(PL74C)* AC1(PL92B/LLC_GPLL0C_MFGOUT1)* AC2(PL89C)* AC3(PL89A/LLC_GPLL0T_MFGOUT2)* AC5(PL83C)* AC6(PL74D)* AC7(PL77C)* AD1(PL92C/LLC_GPLL0T_IN)* AD3(PL86C)* AD4(PL83D)* AD6(PL80A)* AD7(PL77D)* AE1(PL92D/LLC_GPLL0C_IN)* AE2(PL89D)* AE3(PL86D)* AE4(PL80D)* AE5(PL80C)* AE6(PL80B)* N1(PL62A)* P1(PL62B)* P2(PL59A)* P3(PL59B)* P4(PL47B/PCLKC6_1)* P5(PL47A/PCLKT6_1)* R1(PL65A)* R3(PL59C)* R4(PL53A)* R6(PL50A)* R7(PL47C/PCLKT6_0)* T1(PL68A)* T2(PL65B)* T3(PL59D)* T4(PL53C)* T5(PL53B)* T6(PL50B)* T7(PL47D/PCLKC6_0)* U1(PL68B)* U2(PL62C)* U3(PL62D)* U4(PL56A)* U5(PL53D)* U6(PL50C)* U7(PL50D)* V1(PL68C)* V4(PL56B/VREF1_6)* V6(PL56C)* V7(PL56D)* W1(PL68D)* W2(PL86A)* W3(PL65C)* W4(PL74B)* W5(PL71D)* Y1(PL86B)* Y3(PL65D)* Y4(PL74A)* Y5(PL71C)* Y6(PL71B)* Y7(PL71A)*

### Notes on the sheet
- Title
- Engineer
- Revision
- Drawn By
- Checked By
- Date
- Sheet
- of
- (in symbol LFE5U_-85F-_BG756_, part J) BANK 6
- (in symbol LFE5U_-85F-_BG756_, part K) BANK 6

### Library data of the parts
U2 = LFE5U_-85F-_BG756_: as U1 on sheet fpga-bank6; Manufacturer P/N: LFE5U_-85F-_BG756_

## Sheet config-bank7.SchDoc: Config FPGA - Bank 7
size Letter; CompanyName: Brinton Engineering, LLC; Address1: 3479 Edison Way; Address2: Menlo Park CA 94025; Address3: +1 (877) 778-8435; Address4: brintonengineering.com; Revision: 1; SheetNumber: 1; SheetTotal: 1
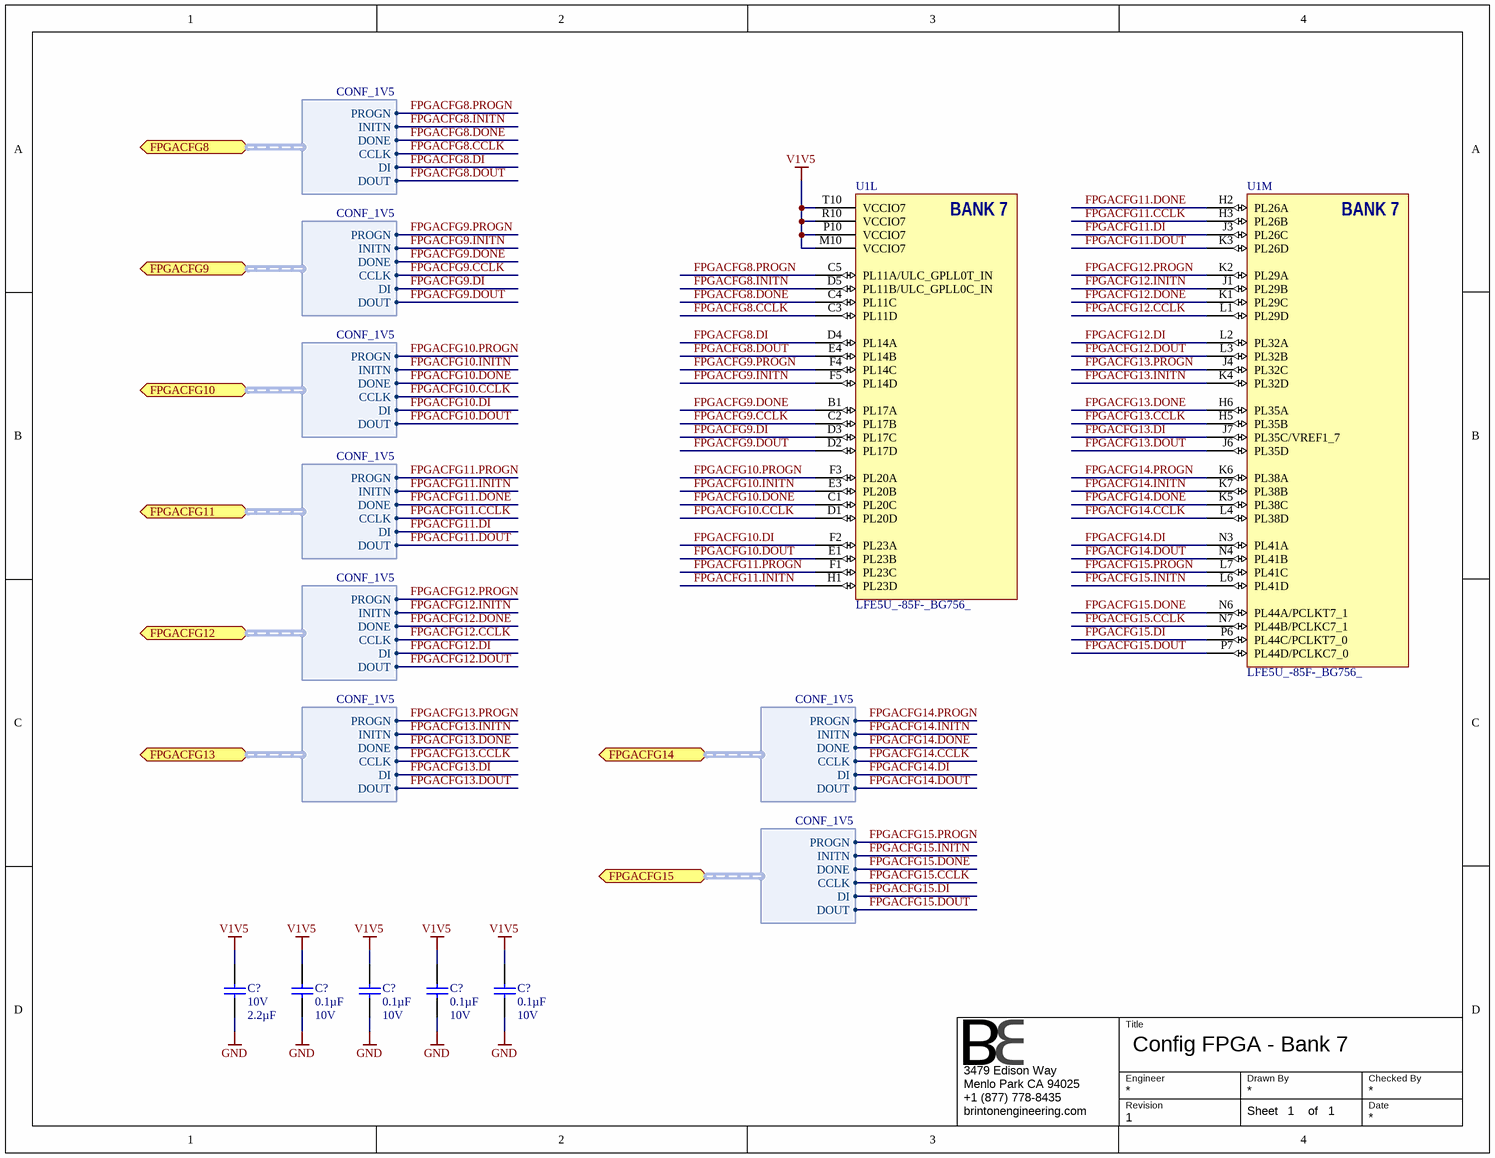
[diagram p14: config-bank7.SchDoc]

### Parts
(Parts that share a designator on the sheet are numbered #1, #2 ... from top to bottom, then left to right.)
C?#26  Voltage - Rated: 10V  Capacitance: 2.2µF  [CAPC1608X90N]  (hidden comment: GRM188R71A225KE15D)
C?#27  Capacitance: 0.1µF  Voltage - Rated: 10V  [CAPC1005X56N]  (hidden comment: GRM155R71A104KA01J)
C?#28  Capacitance: 0.1µF  Voltage - Rated: 10V  [CAPC1005X56N]  (hidden comment: GRM155R71A104KA01J)
C?#29  Capacitance: 0.1µF  Voltage - Rated: 10V  [CAPC1005X56N]  (hidden comment: GRM155R71A104KA01J)
C?#30  Capacitance: 0.1µF  Voltage - Rated: 10V  [CAPC1005X56N]  (hidden comment: GRM155R71A104KA01J)
U1  LFE5U_-85F-_BG756_  [caBGA756]  (parts L,M of 19)

### Ports
FPGACFG8 (harness CONF_1V5), FPGACFG9 (harness CONF_1V5), FPGACFG10 (harness CONF_1V5), FPGACFG11 (harness CONF_1V5), FPGACFG12 (harness CONF_1V5), FPGACFG13 (harness CONF_1V5), FPGACFG14 (harness CONF_1V5), FPGACFG15 (harness CONF_1V5)

### Harnesses
CONF_1V5: PROGN, INITN, DONE, CCLK, DI, DOUT

### Nets
GND: C?#26.1 C?#27.1 C?#28.1 C?#29.1 C?#30.1
V1V5: C?#26.2 C?#27.2 C?#28.2 C?#29.2 C?#30.2 U1.M10(VCCIO7) U1.P10(VCCIO7) U1.R10(VCCIO7) U1.T10(VCCIO7)
FPGACFG8.CCLK: U1.C3(PL11D) ; port FPGACFG8.CCLK
FPGACFG8.DI: U1.D4(PL14A) ; port FPGACFG8.DI
FPGACFG8.DONE: U1.C4(PL11C) ; port FPGACFG8.DONE
FPGACFG8.DOUT: U1.E4(PL14B) ; port FPGACFG8.DOUT
FPGACFG8.INITN: U1.D5(PL11B/ULC_GPLL0C_IN) ; port FPGACFG8.INITN
FPGACFG8.PROGN: U1.C5(PL11A/ULC_GPLL0T_IN) ; port FPGACFG8.PROGN
FPGACFG9.CCLK: U1.C2(PL17B) ; port FPGACFG9.CCLK
FPGACFG9.DI: U1.D3(PL17C) ; port FPGACFG9.DI
FPGACFG9.DONE: U1.B1(PL17A) ; port FPGACFG9.DONE
FPGACFG9.DOUT: U1.D2(PL17D) ; port FPGACFG9.DOUT
FPGACFG9.INITN: U1.F5(PL14D) ; port FPGACFG9.INITN
FPGACFG9.PROGN: U1.F4(PL14C) ; port FPGACFG9.PROGN
FPGACFG10.CCLK: U1.D1(PL20D) ; port FPGACFG10.CCLK
FPGACFG10.DI: U1.F2(PL23A) ; port FPGACFG10.DI
FPGACFG10.DONE: U1.C1(PL20C) ; port FPGACFG10.DONE
FPGACFG10.DOUT: U1.E1(PL23B) ; port FPGACFG10.DOUT
FPGACFG10.INITN: U1.E3(PL20B) ; port FPGACFG10.INITN
FPGACFG10.PROGN: U1.F3(PL20A) ; port FPGACFG10.PROGN
FPGACFG11.CCLK: U1.H3(PL26B) ; port FPGACFG11.CCLK
FPGACFG11.DI: U1.J3(PL26C) ; port FPGACFG11.DI
FPGACFG11.DONE: U1.H2(PL26A) ; port FPGACFG11.DONE
FPGACFG11.DOUT: U1.K3(PL26D) ; port FPGACFG11.DOUT
FPGACFG11.INITN: U1.H1(PL23D) ; port FPGACFG11.INITN
FPGACFG11.PROGN: U1.F1(PL23C) ; port FPGACFG11.PROGN
FPGACFG12.CCLK: U1.L1(PL29D) ; port FPGACFG12.CCLK
FPGACFG12.DI: U1.L2(PL32A) ; port FPGACFG12.DI
FPGACFG12.DONE: U1.K1(PL29C) ; port FPGACFG12.DONE
FPGACFG12.DOUT: U1.L3(PL32B) ; port FPGACFG12.DOUT
FPGACFG12.INITN: U1.J1(PL29B) ; port FPGACFG12.INITN
FPGACFG12.PROGN: U1.K2(PL29A) ; port FPGACFG12.PROGN
FPGACFG13.CCLK: U1.H5(PL35B) ; port FPGACFG13.CCLK
FPGACFG13.DI: U1.J7(PL35C/VREF1_7) ; port FPGACFG13.DI
FPGACFG13.DONE: U1.H6(PL35A) ; port FPGACFG13.DONE
FPGACFG13.DOUT: U1.J6(PL35D) ; port FPGACFG13.DOUT
FPGACFG13.INITN: U1.K4(PL32D) ; port FPGACFG13.INITN
FPGACFG13.PROGN: U1.J4(PL32C) ; port FPGACFG13.PROGN
FPGACFG14.CCLK: U1.L4(PL38D) ; port FPGACFG14.CCLK
FPGACFG14.DI: U1.N3(PL41A) ; port FPGACFG14.DI
FPGACFG14.DONE: U1.K5(PL38C) ; port FPGACFG14.DONE
FPGACFG14.DOUT: U1.N4(PL41B) ; port FPGACFG14.DOUT
FPGACFG14.INITN: U1.K7(PL38B) ; port FPGACFG14.INITN
FPGACFG14.PROGN: U1.K6(PL38A) ; port FPGACFG14.PROGN
FPGACFG15.CCLK: U1.N7(PL44B/PCLKC7_1) ; port FPGACFG15.CCLK
FPGACFG15.DI: U1.P6(PL44C/PCLKT7_0) ; port FPGACFG15.DI
FPGACFG15.DONE: U1.N6(PL44A/PCLKT7_1) ; port FPGACFG15.DONE
FPGACFG15.DOUT: U1.P7(PL44D/PCLKC7_0) ; port FPGACFG15.DOUT
FPGACFG15.INITN: U1.L6(PL41D) ; port FPGACFG15.INITN
FPGACFG15.PROGN: U1.L7(PL41C) ; port FPGACFG15.PROGN

### Notes on the sheet
- Title
- Engineer
- Revision
- Drawn By
- Checked By
- Date
- Sheet
- of
- (in symbol LFE5U_-85F-_BG756_, part L) BANK 7
- (in symbol LFE5U_-85F-_BG756_, part M) BANK 7

### Library data of the parts
C?#26 = GRM188R71A225KE15D: as C?#1 on sheet fpga-bank6; Manufacturer P/N: GRM188R71A225KE15D; Operating Temperature: -55°C ~ 125°C; Thickness (Max): 0.035" (0.90mm); Tolerance: ±10%; Package / Case: 0603 (1608 Metric); Temperature Coefficient: X7R; Supplier 1: Newark; Supplier 2: Digi-Key; RoHS: RoHS Compliant; Size / Dimension: 0.063" L x 0.031" W (1.60mm x 0.80mm); Mounting Type: Surface Mount, MLCC; ComponentLink1URL: http://www.murata.com/~/media/webrenewal/support/library/catalog/products/capacitor/mlcc/c02e.ashx; ComponentLink1Description: http://www.murata.com/~/media/webrenewal/support/library/catalog/products/capacitor/mlcc/c02e.ashx; Supplier Part Number 1: 72R4209; Supplier Part Number 2: 490-4520-1-ND
C?#27-C?#30 = GRM155R71A104KA01J: as C?#2 on sheet fpga-bank6; Manufacturer P/N: GRM155R71A104KA01J; Operating Temperature: -55°C ~ 125°C; Thickness (Max): 0.022" (0.55mm); Size / Dimension: 0.039" L x 0.020" W (1.00mm x 0.50mm); RoHS: RoHS Compliant; Mounting Type: Surface Mount, MLCC; Supplier 1: Digi-Key; ComponentLink1URL: http://www.murata.com/~/media/webrenewal/support/library/catalog/products/capacitor/mlcc/c02e.ashx; ComponentLink1Description: http://www.murata.com/~/media/webrenewal/support/library/catalog/products/capacitor/mlcc/c02e.ashx; Supplier Part Number 1: 490-6322-1-ND; Temperature Coefficient: X7R; Package / Case: 0402 (1005 Metric); Tolerance: ±10%
U1 = LFE5U_-85F-_BG756_: as U1 on sheet fpga-bank6; Manufacturer P/N: LFE5U_-85F-_BG756_

## Sheet config-bank2.SchDoc: Config FPGA - Bank 2
size Letter; CompanyName: Brinton Engineering, LLC; Address1: 3479 Edison Way; Address2: Menlo Park CA 94025; Address3: +1 (877) 778-8435; Address4: brintonengineering.com; Revision: 1; SheetNumber: 1; SheetTotal: 1
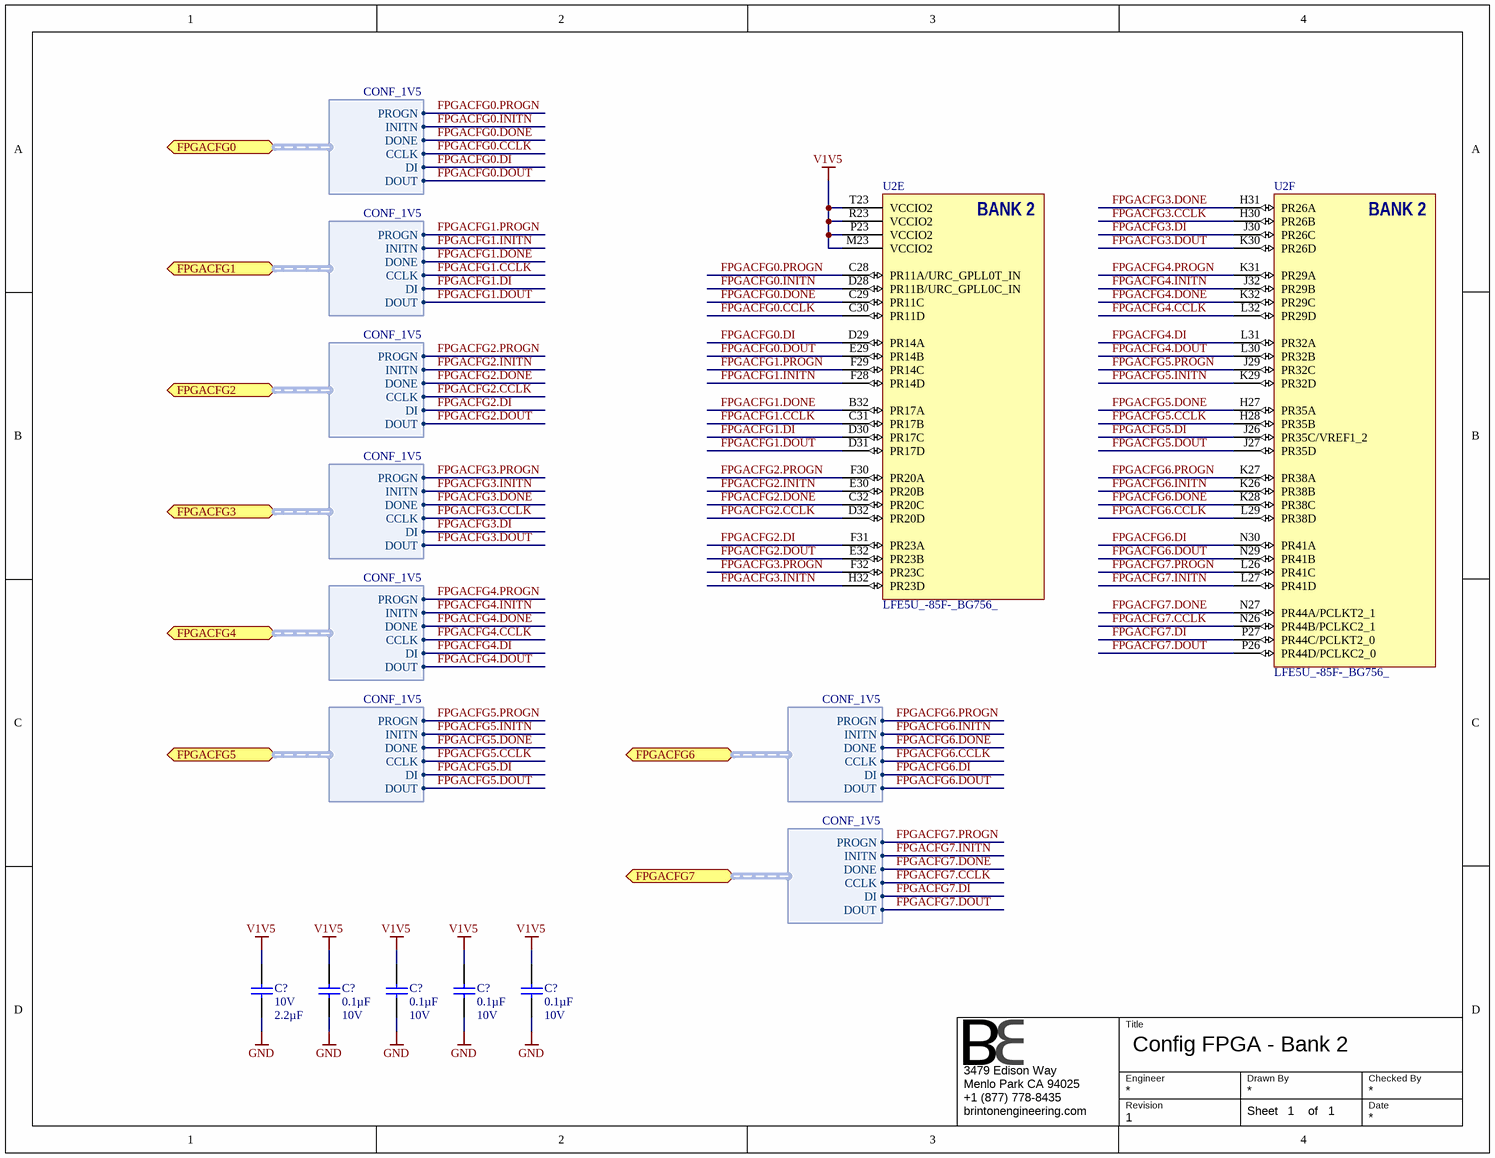
[diagram p15: config-bank2.SchDoc]

### Parts
(Parts that share a designator on the sheet are numbered #1, #2 ... from top to bottom, then left to right.)
C?#31  Voltage - Rated: 10V  Capacitance: 2.2µF  [CAPC1608X90N]  (hidden comment: GRM188R71A225KE15D)
C?#32  Capacitance: 0.1µF  Voltage - Rated: 10V  [CAPC1005X56N]  (hidden comment: GRM155R71A104KA01J)
C?#33  Capacitance: 0.1µF  Voltage - Rated: 10V  [CAPC1005X56N]  (hidden comment: GRM155R71A104KA01J)
C?#34  Capacitance: 0.1µF  Voltage - Rated: 10V  [CAPC1005X56N]  (hidden comment: GRM155R71A104KA01J)
C?#35  Capacitance: 0.1µF  Voltage - Rated: 10V  [CAPC1005X56N]  (hidden comment: GRM155R71A104KA01J)
U2  LFE5U_-85F-_BG756_  [caBGA756]  (parts E,F of 19)

### Ports
FPGACFG0 (harness CONF_1V5), FPGACFG1 (harness CONF_1V5), FPGACFG2 (harness CONF_1V5), FPGACFG3 (harness CONF_1V5), FPGACFG4 (harness CONF_1V5), FPGACFG5 (harness CONF_1V5), FPGACFG6 (harness CONF_1V5), FPGACFG7 (harness CONF_1V5)

### Harnesses
CONF_1V5: PROGN, INITN, DONE, CCLK, DI, DOUT

### Nets
GND: C?#31.1 C?#32.1 C?#33.1 C?#34.1 C?#35.1
V1V5: C?#31.2 C?#32.2 C?#33.2 C?#34.2 C?#35.2 U2.M23(VCCIO2) U2.P23(VCCIO2) U2.R23(VCCIO2) U2.T23(VCCIO2)
FPGACFG0.CCLK: U2.C30(PR11D) ; port FPGACFG0.CCLK
FPGACFG0.DI: U2.D29(PR14A) ; port FPGACFG0.DI
FPGACFG0.DONE: U2.C29(PR11C) ; port FPGACFG0.DONE
FPGACFG0.DOUT: U2.E29(PR14B) ; port FPGACFG0.DOUT
FPGACFG0.INITN: U2.D28(PR11B/URC_GPLL0C_IN) ; port FPGACFG0.INITN
FPGACFG0.PROGN: U2.C28(PR11A/URC_GPLL0T_IN) ; port FPGACFG0.PROGN
FPGACFG1.CCLK: U2.C31(PR17B) ; port FPGACFG1.CCLK
FPGACFG1.DI: U2.D30(PR17C) ; port FPGACFG1.DI
FPGACFG1.DONE: U2.B32(PR17A) ; port FPGACFG1.DONE
FPGACFG1.DOUT: U2.D31(PR17D) ; port FPGACFG1.DOUT
FPGACFG1.INITN: U2.F28(PR14D) ; port FPGACFG1.INITN
FPGACFG1.PROGN: U2.F29(PR14C) ; port FPGACFG1.PROGN
FPGACFG2.CCLK: U2.D32(PR20D) ; port FPGACFG2.CCLK
FPGACFG2.DI: U2.F31(PR23A) ; port FPGACFG2.DI
FPGACFG2.DONE: U2.C32(PR20C) ; port FPGACFG2.DONE
FPGACFG2.DOUT: U2.E32(PR23B) ; port FPGACFG2.DOUT
FPGACFG2.INITN: U2.E30(PR20B) ; port FPGACFG2.INITN
FPGACFG2.PROGN: U2.F30(PR20A) ; port FPGACFG2.PROGN
FPGACFG3.CCLK: U2.H30(PR26B) ; port FPGACFG3.CCLK
FPGACFG3.DI: U2.J30(PR26C) ; port FPGACFG3.DI
FPGACFG3.DONE: U2.H31(PR26A) ; port FPGACFG3.DONE
FPGACFG3.DOUT: U2.K30(PR26D) ; port FPGACFG3.DOUT
FPGACFG3.INITN: U2.H32(PR23D) ; port FPGACFG3.INITN
FPGACFG3.PROGN: U2.F32(PR23C) ; port FPGACFG3.PROGN
FPGACFG4.CCLK: U2.L32(PR29D) ; port FPGACFG4.CCLK
FPGACFG4.DI: U2.L31(PR32A) ; port FPGACFG4.DI
FPGACFG4.DONE: U2.K32(PR29C) ; port FPGACFG4.DONE
FPGACFG4.DOUT: U2.L30(PR32B) ; port FPGACFG4.DOUT
FPGACFG4.INITN: U2.J32(PR29B) ; port FPGACFG4.INITN
FPGACFG4.PROGN: U2.K31(PR29A) ; port FPGACFG4.PROGN
FPGACFG5.CCLK: U2.H28(PR35B) ; port FPGACFG5.CCLK
FPGACFG5.DI: U2.J26(PR35C/VREF1_2) ; port FPGACFG5.DI
FPGACFG5.DONE: U2.H27(PR35A) ; port FPGACFG5.DONE
FPGACFG5.DOUT: U2.J27(PR35D) ; port FPGACFG5.DOUT
FPGACFG5.INITN: U2.K29(PR32D) ; port FPGACFG5.INITN
FPGACFG5.PROGN: U2.J29(PR32C) ; port FPGACFG5.PROGN
FPGACFG6.CCLK: U2.L29(PR38D) ; port FPGACFG6.CCLK
FPGACFG6.DI: U2.N30(PR41A) ; port FPGACFG6.DI
FPGACFG6.DONE: U2.K28(PR38C) ; port FPGACFG6.DONE
FPGACFG6.DOUT: U2.N29(PR41B) ; port FPGACFG6.DOUT
FPGACFG6.INITN: U2.K26(PR38B) ; port FPGACFG6.INITN
FPGACFG6.PROGN: U2.K27(PR38A) ; port FPGACFG6.PROGN
FPGACFG7.CCLK: U2.N26(PR44B/PCLKC2_1) ; port FPGACFG7.CCLK
FPGACFG7.DI: U2.P27(PR44C/PCLKT2_0) ; port FPGACFG7.DI
FPGACFG7.DONE: U2.N27(PR44A/PCLKT2_1) ; port FPGACFG7.DONE
FPGACFG7.DOUT: U2.P26(PR44D/PCLKC2_0) ; port FPGACFG7.DOUT
FPGACFG7.INITN: U2.L27(PR41D) ; port FPGACFG7.INITN
FPGACFG7.PROGN: U2.L26(PR41C) ; port FPGACFG7.PROGN

### Notes on the sheet
- Title
- Engineer
- Revision
- Drawn By
- Checked By
- Date
- Sheet
- of
- (in symbol LFE5U_-85F-_BG756_, part E) BANK 2
- (in symbol LFE5U_-85F-_BG756_, part F) BANK 2

### Library data of the parts
C?#31 = GRM188R71A225KE15D: as C?#1 on sheet fpga-bank6; Manufacturer P/N: GRM188R71A225KE15D; Operating Temperature: -55°C ~ 125°C; Thickness (Max): 0.035" (0.90mm); Tolerance: ±10%; Package / Case: 0603 (1608 Metric); Temperature Coefficient: X7R; Supplier 1: Newark; Supplier 2: Digi-Key; RoHS: RoHS Compliant; Size / Dimension: 0.063" L x 0.031" W (1.60mm x 0.80mm); Mounting Type: Surface Mount, MLCC; ComponentLink1URL: http://www.murata.com/~/media/webrenewal/support/library/catalog/products/capacitor/mlcc/c02e.ashx; ComponentLink1Description: http://www.murata.com/~/media/webrenewal/support/library/catalog/products/capacitor/mlcc/c02e.ashx; Supplier Part Number 1: 72R4209; Supplier Part Number 2: 490-4520-1-ND
C?#32-C?#35 = GRM155R71A104KA01J: as C?#2 on sheet fpga-bank6; Manufacturer P/N: GRM155R71A104KA01J; Operating Temperature: -55°C ~ 125°C; Thickness (Max): 0.022" (0.55mm); Size / Dimension: 0.039" L x 0.020" W (1.00mm x 0.50mm); RoHS: RoHS Compliant; Mounting Type: Surface Mount, MLCC; Supplier 1: Digi-Key; ComponentLink1URL: http://www.murata.com/~/media/webrenewal/support/library/catalog/products/capacitor/mlcc/c02e.ashx; ComponentLink1Description: http://www.murata.com/~/media/webrenewal/support/library/catalog/products/capacitor/mlcc/c02e.ashx; Supplier Part Number 1: 490-6322-1-ND; Temperature Coefficient: X7R; Package / Case: 0402 (1005 Metric); Tolerance: ±10%
U2 = LFE5U_-85F-_BG756_: as U1 on sheet fpga-bank6; Manufacturer P/N: LFE5U_-85F-_BG756_